# EAGLE design cdu (EAGLE 8.4.1)

## Sheet 1 of 9: USB
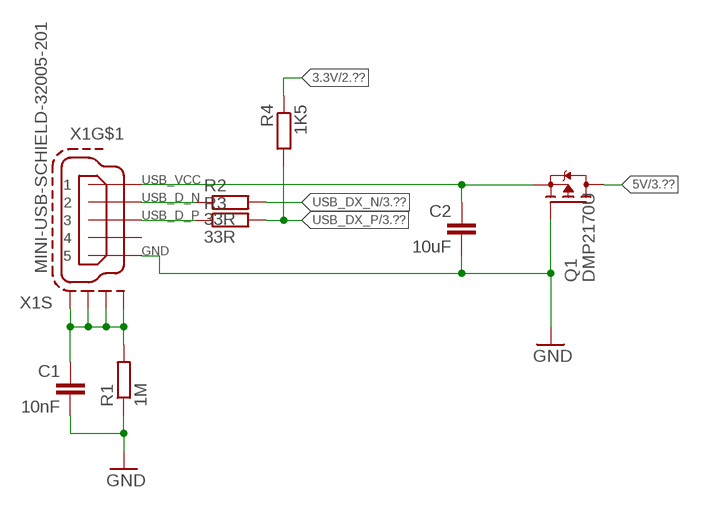
[diagram p0: schematic, sheet 1]

### Parts
C1  10nF  C-EUC0603  [C0603]
C2  10uF  C-EUC0805K  [C0805K]
Q1  DMP2170U  [SOT23]
R1  1M  R-EU_R0603  [R0603]
R2  33R  R-EU_R0603  [R0603]
R3  33R  R-EU_R0603  [R0603]
R4  1K5  R-EU_R0603  [R0603]
X1  MINI-USB-SCHIELD-32005-201  [32005-201]

### Nets
3.3V [Power]: R4.1 ; also sheet 2,3,4,6,8,9
5V [Power]: Q1.3(D) ; also sheet 3,5,6,9
GND [Power]: C1.2 C2.2 Q1.1(G) R1.1 X1.5 ; also sheet 2,3,4,5,6,7,9
N$60: C1.1 R1.2 X1.M1(S:S1) X1.M2(S:S2) X1.M3(S:S3) X1.M4(S:S4)
USB_D_N: R2.1 X1.2
USB_D_P: R3.1 X1.3
USB_DX_N: R2.2 ; also sheet 3
USB_DX_P: R3.2 R4.2 ; also sheet 3
USB_VCC: C2.1 Q1.2(S) X1.1
Unconnected: X1.4

## Sheet 2 of 9: CPLD LCMXO1200C-3TN144I breakout
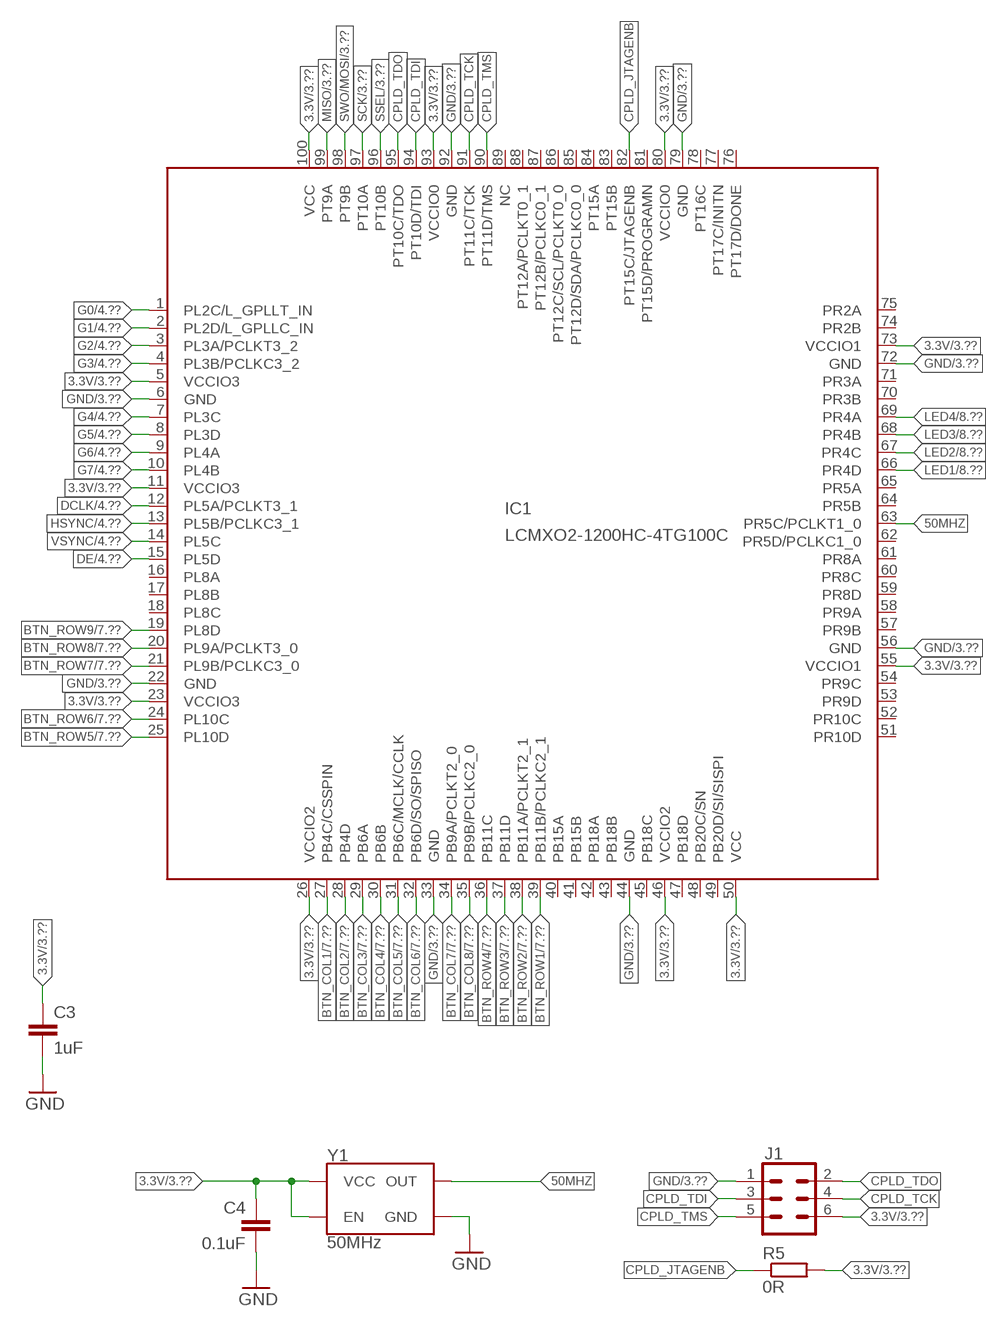
[diagram p1: schematic, sheet 2]

### Parts
C3  1uF  C-EUC0603  [C0603]
C4  0.1uF  C-EUC0603  [C0603]
IC1  LCMXO2-1200HC-4TG100C  [TQFP100]
J1  CONN_03X2FEMALE_SMD  [2X3_SMD]
R5  0R  R-EU_R0603  [R0603]
Y1  50MHz  LFSPXO019987  [CFPS-73]

### Nets
3.3V [Power]: C3.1 C4.1 IC1.5(VCCIO3) IC1.11(VCCIO3) IC1.23(VCCIO3) IC1.26(VCCIO2) IC1.46(VCCIO2) IC1.50(VCC) IC1.55(VCCIO1) IC1.73(VCCIO1) IC1.80(VCCIO0) IC1.93(VCCIO0) IC1.100(VCC) J1.6 R5.2 Y1.1(EN) Y1.4(VCC) ; also sheet 1,3,4,6,8,9
50MHZ: IC1.63(PR5C/PCLKT1_0) Y1.3(OUT)
BTN_COL1: IC1.27(PB4C/CSSPIN) ; also sheet 7
BTN_COL2: IC1.28(PB4D) ; also sheet 7
BTN_COL3: IC1.29(PB6A) ; also sheet 7
BTN_COL4: IC1.30(PB6B) ; also sheet 7
BTN_COL5: IC1.31(PB6C/MCLK/CCLK) ; also sheet 7
BTN_COL6: IC1.32(PB6D/SO/SPISO) ; also sheet 7
BTN_COL7: IC1.34(PB9A/PCLKT2_0) ; also sheet 7
BTN_COL8: IC1.35(PB9B/PCLKC2_0) ; also sheet 7
BTN_ROW1: IC1.39(PB11B/PCLKC2_1) ; also sheet 7
BTN_ROW2: IC1.38(PB11A/PCLKT2_1) ; also sheet 7
BTN_ROW3: IC1.37(PB11D) ; also sheet 7
BTN_ROW4: IC1.36(PB11C) ; also sheet 7
BTN_ROW5: IC1.25(PL10D) ; also sheet 7
BTN_ROW6: IC1.24(PL10C) ; also sheet 7
BTN_ROW7: IC1.21(PL9B/PCLKC3_0) ; also sheet 7
BTN_ROW8: IC1.20(PL9A/PCLKT3_0) ; also sheet 7
BTN_ROW9: IC1.19(PL8D) ; also sheet 7
CPLD_JTAGENB: IC1.82(PT15C/JTAGENB) R5.1
CPLD_TCK: IC1.91(PT11C/TCK) J1.4
CPLD_TDI: IC1.94(PT10D/TDI) J1.3
CPLD_TDO: IC1.95(PT10C/TDO) J1.2
CPLD_TMS: IC1.90(PT11D/TMS) J1.5
DCLK: IC1.12(PL5A/PCLKT3_1) ; also sheet 4
DE: IC1.15(PL5D) ; also sheet 4
G0: IC1.1(PL2C/L_GPLLT_IN) ; also sheet 4
G1: IC1.2(PL2D/L_GPLLC_IN) ; also sheet 4
G2: IC1.3(PL3A/PCLKT3_2) ; also sheet 4
G3: IC1.4(PL3B/PCLKC3_2) ; also sheet 4
G4: IC1.7(PL3C) ; also sheet 4
G5: IC1.8(PL3D) ; also sheet 4
G6: IC1.9(PL4A) ; also sheet 4
G7: IC1.10(PL4B) ; also sheet 4
GND [Power]: C3.2 C4.2 IC1.6(GND) IC1.22(GND) IC1.33(GND) IC1.44(GND) IC1.56(GND) IC1.72(GND) IC1.79(GND) IC1.92(GND) J1.1 Y1.2(GND) ; also sheet 1,3,4,5,6,7,9
HSYNC: IC1.13(PL5B/PCLKC3_1) ; also sheet 4
LED1: IC1.66(PR4D) ; also sheet 8
LED2: IC1.67(PR4C) ; also sheet 8
LED3: IC1.68(PR4B) ; also sheet 8
LED4: IC1.69(PR4A) ; also sheet 8
MISO: IC1.99(PT9A) ; also sheet 3
SCK: IC1.97(PT10A) ; also sheet 3
SSEL: IC1.96(PT10B) ; also sheet 3
SWO/MOSI: IC1.98(PT9B) ; also sheet 3
VSYNC: IC1.14(PL5C) ; also sheet 4
Unconnected: IC1.16(PL8A) IC1.17(PL8B) IC1.18(PL8C) IC1.40(PB15A) IC1.41(PB15B) IC1.42(PB18A) IC1.43(PB18B) IC1.45(PB18C) IC1.47(PB18D) IC1.48(PB20C/SN) IC1.49(PB20D/SI/SISPI) IC1.51(PR10D) IC1.52(PR10C) IC1.53(PR9D) IC1.54(PR9C) IC1.57(PR9B) IC1.58(PR9A) IC1.59(PR8D) IC1.60(PR8C) IC1.61(PR8A) IC1.62(PR5D/PCLKC1_0) IC1.64(PR5B) IC1.65(PR5A) IC1.70(PR3B) IC1.71(PR3A) IC1.74(PR2B) IC1.75(PR2A) IC1.76(PT17D/DONE) IC1.77(PT17C/INITN) IC1.78(PT16C) IC1.81(PT15D/PROGRAMN) IC1.83(PT15B) IC1.84(PT15A) IC1.85(PT12D/SDA/PCLKC0_0) IC1.86(PT12C/SCL/PCLKT0_0) IC1.87(PT12B/PCLKC0_1) IC1.88(PT12A/PCLKT0_1) IC1.89(NC)

## Sheet 3 of 9: MCU LPC1313 of 72MHz
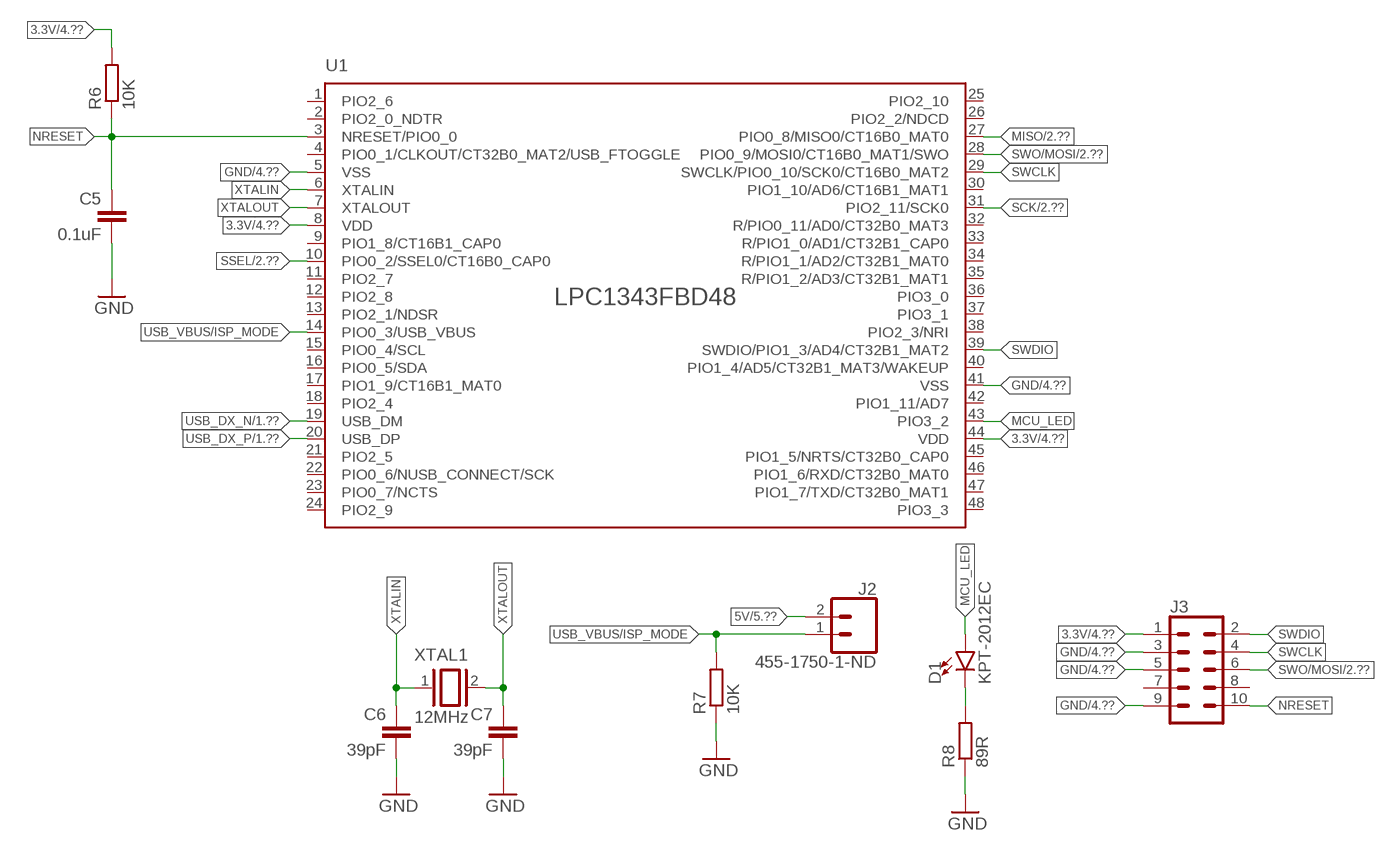
[diagram p2: schematic, sheet 3]

### Parts
C5  0.1uF  C-EUC0603  [C0603]
C6  39pF  C-EUC0603  [C0603]
C7  39pF  C-EUC0603  [C0603]
D1  KPT-2012EC  [KPT-2012EC]
J2  455-1750-1-ND  CONN_02SMD  [1X02_SMD]
J3  CONN_05X2SMD_12.7  [2X5_SMD_1.27MM]
R6  10K  R-EU_R0603  [R0603]
R7  10K  R-EU_R0603  [R0603]
R8  89R  R-EU_R0603  [R0603]
U1  LPC1343FBD48  [LQFP-48]
XTAL1  12MHz  CRYSTAL  [CAA-12.000-18-3050-X]

### Nets
3.3V [Power]: J3.1 R6.2 U1.8(VDD) U1.44(VDD) ; also sheet 1,2,4,6,8,9
5V [Power]: J2.2 ; also sheet 1,5,6,9
GND [Power]: C5.2 C6.2 C7.2 J3.3 J3.5 J3.9 R7.1 R8.1 U1.5(VSS) U1.41(VSS) ; also sheet 1,2,4,5,6,7,9
MCU_LED: D1.A U1.43(PIO3_2)
MISO: U1.27(PIO0_8/MISO0/CT16B0_MAT0) ; also sheet 2
N$6: D1.C R8.2
NRESET: C5.1 J3.10 R6.1 U1.3(NRESET/PIO0_0)
SCK: U1.31(PIO2_11/SCK0) ; also sheet 2
SSEL: U1.10(PIO0_2/SSEL0/CT16B0_CAP0) ; also sheet 2
SWCLK: J3.4 U1.29(SWCLK/PIO0_10/SCK0/CT16B0_MAT2)
SWDIO: J3.2 U1.39(SWDIO/PIO1_3/AD4/CT32B1_MAT2)
SWO/MOSI: J3.6 U1.28(PIO0_9/MOSI0/CT16B0_MAT1/SWO) ; also sheet 2
USB_DX_N: U1.19(USB_DM) ; also sheet 1
USB_DX_P: U1.20(USB_DP) ; also sheet 1
USB_VBUS/ISP_MODE: J2.1 R7.2 U1.14(PIO0_3/USB_VBUS)
XTALIN: C6.1 U1.6(XTALIN) XTAL1.1
XTALOUT: C7.1 U1.7(XTALOUT) XTAL1.2
Unconnected: J3.7 J3.8 U1.1(PIO2_6) U1.2(PIO2_0_NDTR) U1.4(PIO0_1/CLKOUT/CT32B0_MAT2/USB_FTOGGLE) U1.9(PIO1_8/CT16B1_CAP0) U1.11(PIO2_7) U1.12(PIO2_8) U1.13(PIO2_1/NDSR) U1.15(PIO0_4/SCL) U1.16(PIO0_5/SDA) U1.17(PIO1_9/CT16B1_MAT0) U1.18(PIO2_4) U1.21(PIO2_5) U1.22(PIO0_6/NUSB_CONNECT/SCK) U1.23(PIO0_7/NCTS) U1.24(PIO2_9) U1.25(PIO2_10) U1.26(PIO2_2/NDCD) U1.30(PIO1_10/AD6/CT16B1_MAT1) U1.32(R/PIO0_11/AD0/CT32B0_MAT3) U1.33(R/PIO1_0/AD1/CT32B1_CAP0) U1.34(R/PIO1_1/AD2/CT32B1_MAT0) U1.35(R/PIO1_2/AD3/CT32B1_MAT1) U1.36(PIO3_0) U1.37(PIO3_1) U1.38(PIO2_3/NRI) U1.40(PIO1_4/AD5/CT32B1_MAT3/WAKEUP) U1.42(PIO1_11/AD7) U1.45(PIO1_5/NRTS/CT32B0_CAP0) U1.46(PIO1_6/RXD/CT32B0_MAT0) U1.47(PIO1_7/TXD/CT32B0_MAT1) U1.48(PIO3_3)

## Sheet 4 of 9
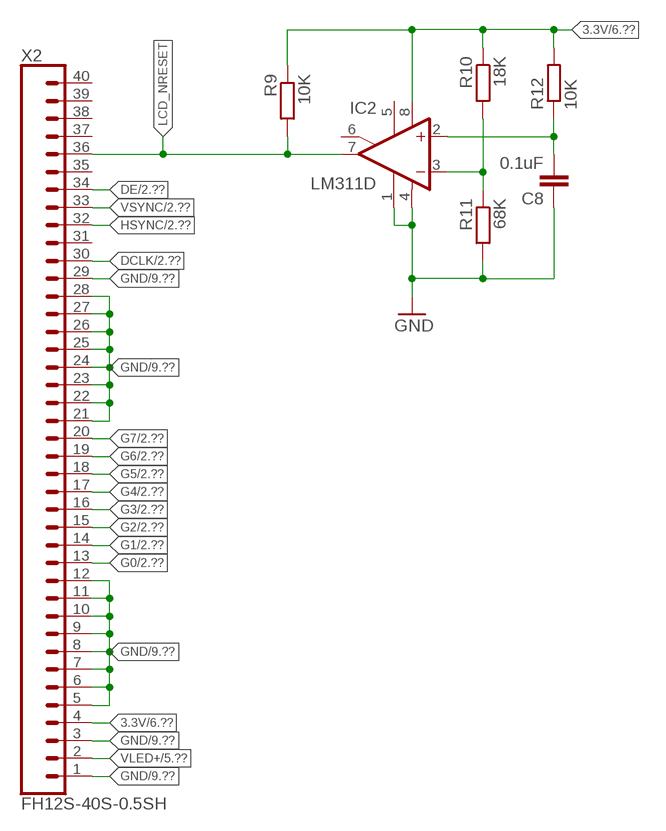
[diagram p3: schematic, sheet 4]

### Parts
C8  0.1uF  C-EUC0603  [C0603]
IC2  LM311D  [SO08]
R9  10K  R-EU_R0603  [R0603]
R10  18K  R-EU_R0603  [R0603]
R11  68K  R-EU_R0603  [R0603]
R12  10K  R-EU_R0603  [R0603]
X2  FH12S-40S-0.5SH  [FH12S-40S-0.5SH]

### Nets
3.3V [Power]: IC2.8(V+) R9.1 R10.1 R12.2 X2.4 ; also sheet 1,2,3,6,8,9
DCLK: X2.30 ; also sheet 2
DE: X2.34 ; also sheet 2
G0: X2.13 ; also sheet 2
G1: X2.14 ; also sheet 2
G2: X2.15 ; also sheet 2
G3: X2.16 ; also sheet 2
G4: X2.17 ; also sheet 2
G5: X2.18 ; also sheet 2
G6: X2.19 ; also sheet 2
G7: X2.20 ; also sheet 2
GND [Power]: C8.1 IC2.1(GND) IC2.4(V-) R11.2 X2.1 X2.3 X2.5 X2.6 X2.7 X2.8 X2.9 X2.10 X2.11 X2.12 X2.21 X2.22 X2.23 X2.24 X2.25 X2.26 X2.27 X2.28 X2.29 ; also sheet 1,2,3,5,6,7,9
HSYNC: X2.32 ; also sheet 2
LCD_NRESET: IC2.7(OUT) R9.2 X2.36
N$4: C8.2 IC2.2(+IN) R12.1
N$8: IC2.3(-IN) R10.2 R11.1
VLED+: X2.2 ; also sheet 5,9
VSYNC: X2.33 ; also sheet 2
Unconnected: IC2.5(ON) IC2.6(ON/STR) X2.31 X2.35 X2.37 X2.38 X2.39 X2.40

## Sheet 5 of 9: VLED SUPPLY 20V VLED power supply. The supply is rated for 30mA current.
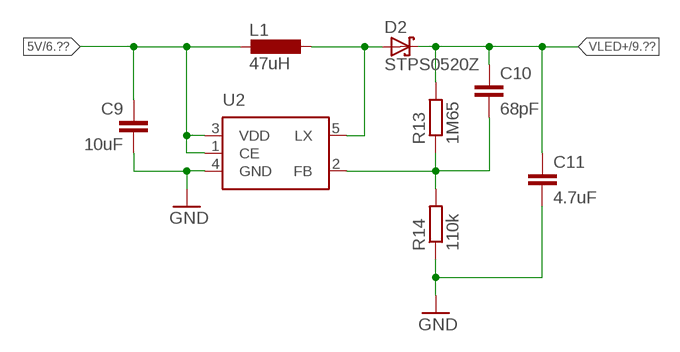
[diagram p4: schematic, sheet 5]

### Parts
C9  10uF  C-EUC0805K  [C0805K]
C10  68pF  C-EUC0603  [C0603]
C11  4.7uF  C-EUC0603  [C0603]
D2  STPS0520Z  [SOD123]
L1  47uH  TYS4018470M-10  [TYS4018470M-10]
R13  1M65  R-EU_R0603  [R0603]
R14  110k  R-EU_R0603  [R0603]
U2  NCP1406  [TSOP-5]

### Nets
5V [Power]: C9.1 L1.2 U2.1(CE) U2.3(VDD) ; also sheet 1,3,6,9
GND [Power]: C9.2 C11.2 R14.1 U2.4(GND) ; also sheet 1,2,3,4,6,7,9
N$1: D2.A L1.1 U2.5(LX)
N$3: C10.2 R13.1 R14.2 U2.2(FB)
VLED+: C10.1 C11.1 D2.C R13.2 ; also sheet 4,9

## Sheet 6 of 9: VCC 3.3V Power supply VCC 3.3V Power supply rated for 300mA
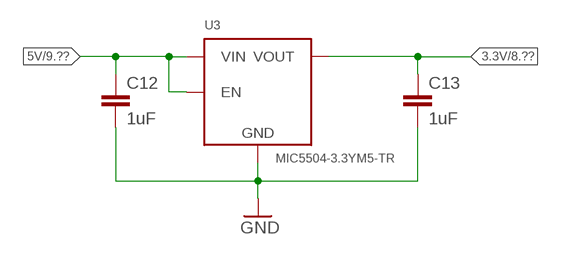
[diagram p5: schematic, sheet 6]

### Parts
C12  1uF  C-EUC0603  [C0603]
C13  1uF  C-EUC0603  [C0603]
U3  MIC5504-3.3YM5-TR  [SOT23-5]

### Nets
3.3V [Power]: C13.1 U3.5(VOUT) ; also sheet 1,2,3,4,8,9
5V [Power]: C12.1 U3.1(VIN) U3.3(EN) ; also sheet 1,3,5,9
GND [Power]: C12.2 C13.2 U3.2(GND) ; also sheet 1,2,3,4,5,7,9

## Sheet 7 of 9: Buttons Pull-Down tactile SMD buttons
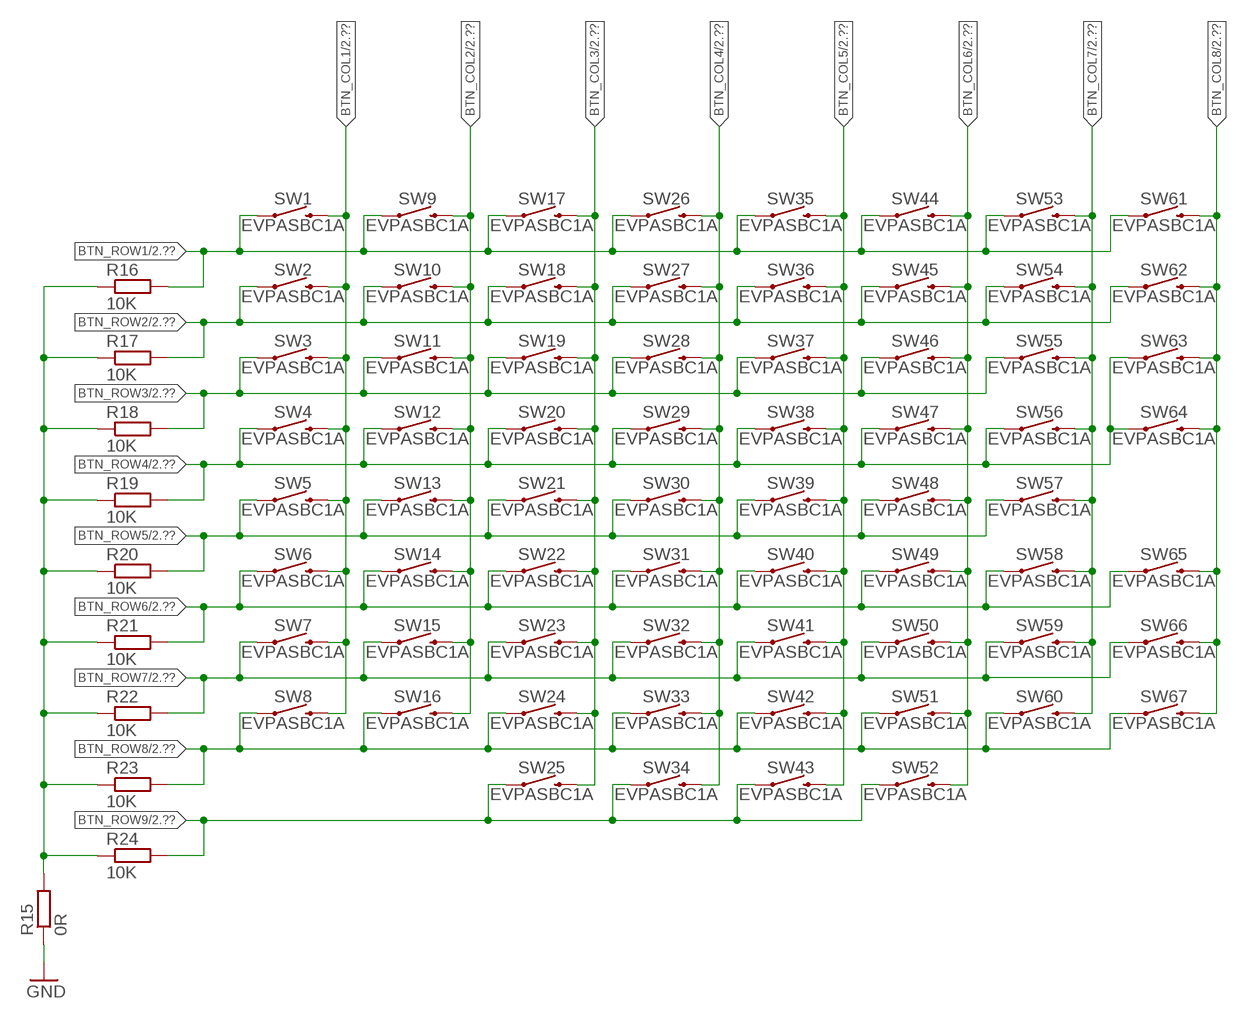
[diagram p6: schematic, sheet 7]

### Parts
R15  0R  R-EU_R0603  [R0603]
R16  10K  R-EU_R0603  [R0603]
R17  10K  R-EU_R0603  [R0603]
R18  10K  R-EU_R0603  [R0603]
R19  10K  R-EU_R0603  [R0603]
R20  10K  R-EU_R0603  [R0603]
R21  10K  R-EU_R0603  [R0603]
R22  10K  R-EU_R0603  [R0603]
R23  10K  R-EU_R0603  [R0603]
R24  10K  R-EU_R0603  [R0603]
SW1  EVPASBC1A  [EVPASBC1A]
SW2  EVPASBC1A  [EVPASBC1A]
SW3  EVPASBC1A  [EVPASBC1A]
SW4  EVPASBC1A  [EVPASBC1A]
SW5  EVPASBC1A  [EVPASBC1A]
SW6  EVPASBC1A  [EVPASBC1A]
SW7  EVPASBC1A  [EVPASBC1A]
SW8  EVPASBC1A  [EVPASBC1A]
SW9  EVPASBC1A  [EVPASBC1A]
SW10  EVPASBC1A  [EVPASBC1A]
SW11  EVPASBC1A  [EVPASBC1A]
SW12  EVPASBC1A  [EVPASBC1A]
SW13  EVPASBC1A  [EVPASBC1A]
SW14  EVPASBC1A  [EVPASBC1A]
SW15  EVPASBC1A  [EVPASBC1A]
SW16  EVPASBC1A  [EVPASBC1A]
SW17  EVPASBC1A  [EVPASBC1A]
SW18  EVPASBC1A  [EVPASBC1A]
SW19  EVPASBC1A  [EVPASBC1A]
SW20  EVPASBC1A  [EVPASBC1A]
SW21  EVPASBC1A  [EVPASBC1A]
SW22  EVPASBC1A  [EVPASBC1A]
SW23  EVPASBC1A  [EVPASBC1A]
SW24  EVPASBC1A  [EVPASBC1A]
SW25  EVPASBC1A  [EVPASBC1A]
SW26  EVPASBC1A  [EVPASBC1A]
SW27  EVPASBC1A  [EVPASBC1A]
SW28  EVPASBC1A  [EVPASBC1A]
SW29  EVPASBC1A  [EVPASBC1A]
SW30  EVPASBC1A  [EVPASBC1A]
SW31  EVPASBC1A  [EVPASBC1A]
SW32  EVPASBC1A  [EVPASBC1A]
SW33  EVPASBC1A  [EVPASBC1A]
SW34  EVPASBC1A  [EVPASBC1A]
SW35  EVPASBC1A  [EVPASBC1A]
SW36  EVPASBC1A  [EVPASBC1A]
SW37  EVPASBC1A  [EVPASBC1A]
SW38  EVPASBC1A  [EVPASBC1A]
SW39  EVPASBC1A  [EVPASBC1A]
SW40  EVPASBC1A  [EVPASBC1A]
SW41  EVPASBC1A  [EVPASBC1A]
SW42  EVPASBC1A  [EVPASBC1A]
SW43  EVPASBC1A  [EVPASBC1A]
SW44  EVPASBC1A  [EVPASBC1A]
SW45  EVPASBC1A  [EVPASBC1A]
SW46  EVPASBC1A  [EVPASBC1A]
SW47  EVPASBC1A  [EVPASBC1A]
SW48  EVPASBC1A  [EVPASBC1A]
SW49  EVPASBC1A  [EVPASBC1A]
SW50  EVPASBC1A  [EVPASBC1A]
SW51  EVPASBC1A  [EVPASBC1A]
SW52  EVPASBC1A  [EVPASBC1A]
SW53  EVPASBC1A  [EVPASBC1A]
SW54  EVPASBC1A  [EVPASBC1A]
SW55  EVPASBC1A  [EVPASBC1A]
SW56  EVPASBC1A  [EVPASBC1A]
SW57  EVPASBC1A  [EVPASBC1A]
SW58  EVPASBC1A  [EVPASBC1A]
SW59  EVPASBC1A  [EVPASBC1A]
SW60  EVPASBC1A  [EVPASBC1A]
SW61  EVPASBC1A  [EVPASBC1A]
SW62  EVPASBC1A  [EVPASBC1A]
SW63  EVPASBC1A  [EVPASBC1A]
SW64  EVPASBC1A  [EVPASBC1A]
SW65  EVPASBC1A  [EVPASBC1A]
SW66  EVPASBC1A  [EVPASBC1A]
SW67  EVPASBC1A  [EVPASBC1A]

### Nets
BTN_COL1: SW1.P$2 SW2.P$2 SW3.P$2 SW4.P$2 SW5.P$2 SW6.P$2 SW7.P$2 SW8.P$2 ; also sheet 2
BTN_COL2: SW9.P$2 SW10.P$2 SW11.P$2 SW12.P$2 SW13.P$2 SW14.P$2 SW15.P$2 SW16.P$2 ; also sheet 2
BTN_COL3: SW17.P$2 SW18.P$2 SW19.P$2 SW20.P$2 SW21.P$2 SW22.P$2 SW23.P$2 SW24.P$2 SW25.P$2 ; also sheet 2
BTN_COL4: SW26.P$2 SW27.P$2 SW28.P$2 SW29.P$2 SW30.P$2 SW31.P$2 SW32.P$2 SW33.P$2 SW34.P$2 ; also sheet 2
BTN_COL5: SW35.P$2 SW36.P$2 SW37.P$2 SW38.P$2 SW39.P$2 SW40.P$2 SW41.P$2 SW42.P$2 SW43.P$2 ; also sheet 2
BTN_COL6: SW44.P$2 SW45.P$2 SW46.P$2 SW47.P$2 SW48.P$2 SW49.P$2 SW50.P$2 SW51.P$2 SW52.P$2 ; also sheet 2
BTN_COL7: SW53.P$2 SW54.P$2 SW55.P$2 SW56.P$2 SW57.P$2 SW58.P$2 SW59.P$2 SW60.P$2 ; also sheet 2
BTN_COL8: SW61.P$2 SW62.P$2 SW63.P$2 SW64.P$2 SW65.P$2 SW66.P$2 SW67.P$2 ; also sheet 2
BTN_ROW1: R16.2 SW1.P$1 SW9.P$1 SW17.P$1 SW26.P$1 SW35.P$1 SW44.P$1 SW53.P$1 SW61.P$1 ; also sheet 2
BTN_ROW2: R17.2 SW2.P$1 SW10.P$1 SW18.P$1 SW27.P$1 SW36.P$1 SW45.P$1 SW54.P$1 SW62.P$1 ; also sheet 2
BTN_ROW3: R18.2 SW3.P$1 SW11.P$1 SW19.P$1 SW28.P$1 SW37.P$1 SW46.P$1 SW55.P$1 ; also sheet 2
BTN_ROW4: R19.2 SW4.P$1 SW12.P$1 SW20.P$1 SW29.P$1 SW38.P$1 SW47.P$1 SW56.P$1 SW63.P$1 SW64.P$1 ; also sheet 2
BTN_ROW5: R20.2 SW5.P$1 SW13.P$1 SW21.P$1 SW30.P$1 SW39.P$1 SW48.P$1 SW57.P$1 ; also sheet 2
BTN_ROW6: R21.2 SW6.P$1 SW14.P$1 SW22.P$1 SW31.P$1 SW40.P$1 SW49.P$1 SW58.P$1 SW65.P$1 ; also sheet 2
BTN_ROW7: R22.2 SW7.P$1 SW15.P$1 SW23.P$1 SW32.P$1 SW41.P$1 SW50.P$1 SW59.P$1 SW66.P$1 ; also sheet 2
BTN_ROW8: R23.2 SW8.P$1 SW16.P$1 SW24.P$1 SW33.P$1 SW42.P$1 SW51.P$1 SW60.P$1 SW67.P$1 ; also sheet 2
BTN_ROW9: R24.2 SW25.P$1 SW34.P$1 SW43.P$1 SW52.P$1 ; also sheet 2
GND [Power]: R15.1 ; also sheet 1,2,3,4,5,6,9
N$10: R15.2 R16.1 R17.1 R18.1 R19.1 R20.1 R21.1 R22.1 R23.1 R24.1

## Sheet 8 of 9: LED's
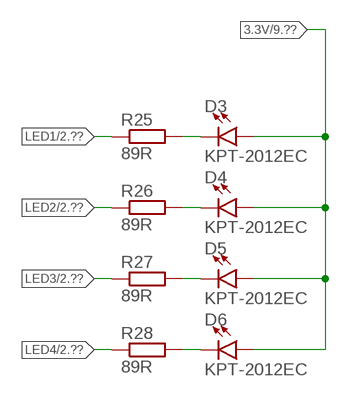
[diagram p7: schematic, sheet 8]

### Parts
D3  KPT-2012EC  [KPT-2012EC]
D4  KPT-2012EC  [KPT-2012EC]
D5  KPT-2012EC  [KPT-2012EC]
D6  KPT-2012EC  [KPT-2012EC]
R25  89R  R-EU_R0603  [R0603]
R26  89R  R-EU_R0603  [R0603]
R27  89R  R-EU_R0603  [R0603]
R28  89R  R-EU_R0603  [R0603]

### Nets
3.3V [Power]: D3.A D4.A D5.A D6.A ; also sheet 1,2,3,4,6,9
LED1: R25.1 ; also sheet 2
LED2: R26.1 ; also sheet 2
LED3: R27.1 ; also sheet 2
LED4: R28.1 ; also sheet 2
N$5: D4.C R26.2
N$7: D5.C R27.2
N$9: D6.C R28.2
N$17: D3.C R25.2

## Sheet 9 of 9: Test points
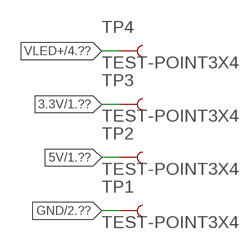
[diagram p8: schematic, sheet 9]

### Parts
TP1  TEST-POINT3X4  [PAD.03X.04]
TP2  TEST-POINT3X4  [PAD.03X.04]
TP3  TEST-POINT3X4  [PAD.03X.04]
TP4  TEST-POINT3X4  [PAD.03X.04]

### Nets
3.3V [Power]: TP3.P$1 ; also sheet 1,2,3,4,6,8
5V [Power]: TP2.P$1 ; also sheet 1,3,5,6
GND [Power]: TP1.P$1 ; also sheet 1,2,3,4,5,6,7
VLED+: TP4.P$1 ; also sheet 4,5

## Library data of the parts
C1-C13 = resistor:C-EU: CAPACITOR, European symbol
D1 D3-D6 = mylib:KPT-2012EC
D2 = mylib:STPS0520Z
IC1 = mylib:LCMXO2-1200HC-4TG100C: edit this description Auto generated by make-symbol-device-package-bsdl.ulp Rev. 44 Source:
IC2 = linear:LM311: COMPARATOR
J1 = SparkFun-Connectors:CONN_03X2: Multi connection point. Often used as Generic Header-pin footprint for 0.1 inch spaced/style header connections You can populate with any combo of single row headers, but if you'd like an exact match, check these: Header - 2x3 (Male, 0.1") <https://www.sparkfun.com/products/12807> (PRT-12807) Header - 2x3 (Female, 0.1") <https://www.sparkfun.com/products/13010> (PRT-13010) 2x3 Pin Shrouded Header <https://www.sparkfun.com/products/10877> (PRT-10877) On any of the 0.1 inch spaced packages, you can populate with these: Break Away Headers - Straight <https://www.sparkfun.com/products/116> (PRT-00116) Break Away Male Headers - Right Angle <https://www.sparkfun.com/products/553> (PRT-00553) Female Headers <https://www.sparkfun.com/products/115> (PRT-00115) Break Away Headers - Machine Pin <https://www.sparkfun.com/products/117> (PRT-00117) Break Away Female Headers - Swiss Machine Pin <https://www.sparkfun.com/products/743> (PRT-00743) Special note: the shrouded connector mates well with our 3x2 ribbon cables: Ribbon Crimp Connector - 6-pin (2x3, Female) <https://www.sparkfun.com/products/10651> (PRT-10651) Ribbon Cable - 6 wire (15ft) <https://www.sparkfun.com/products/10646> (PRT-10646); PROD_ID: CONN-11290
J2 = SparkFun-Connectors:CONN_02: Multi connection point. Often used as Generic Header-pin footprint for 0.1 inch spaced/style header connections On any of the 0.1 inch spaced packages, you can populate with these: Break Away Headers - Straight <https://www.sparkfun.com/products/116> (PRT-00116) Break Away Male Headers - Right Angle <https://www.sparkfun.com/products/553> (PRT-00553) Female Headers <https://www.sparkfun.com/products/115> (PRT-00115) Break Away Headers - Machine Pin <https://www.sparkfun.com/products/117> (PRT-00117) Break Away Female Headers - Swiss Machine Pin <https://www.sparkfun.com/products/743> (PRT-00743) For SCREWTERMINALS and SPRING TERMINALS visit here: Screw Terimnals on SparkFun.com <https://www.sparkfun.com/search/results?term=Screw+Terminals> (5mm/3.5mm/2.54mm spacing) This device is also useful as a general connection point to wire up your design to another part of your project. Our various solder wires solder well into these plated through hole pads. Hook-Up Wire - Assortment (Stranded, 22 AWG) <https://www.sparkfun.com/products/11375> (PRT-11375) Hook-Up Wire - Assortment (Solid Core, 22 AWG) <https://www.sparkfun.com/products/11367> (PRT-11367) View the entire wire category on our website here <https://www.sparkfun.com/categories/141> Special notes: Molex polarized connector foot print use with: PRT-08233 with associated crimp pins and housings. 2.54_SCREWTERM for use with PRT-10571. 3.5mm Screw Terminal footprints for PRT-08084 5mm Screw Terminal footprints for use with PRT-08432
J3 = SparkFun-Connectors:CONN_05X2: Multi connection point. Often used as Generic Header-pin footprint for 0.1 inch spaced/style header connections For AVR SPI programming port, see special device with nice symbol: "AVR_SPI_PROG_5x2.dev" You can populate with any combo of single row headers, but if you'd like an exact match, check these: 2x5 AVR ICSP Male Header <https://www.sparkfun.com/products/778> (PRT-00778) 2x5 Pin Shrouded Header <https://www.sparkfun.com/products/8506> (PRT-08506) On any of the 0.1 inch spaced packages, you can populate with these: Break Away Headers - Straight <https://www.sparkfun.com/products/116> (PRT-00116) Break Away Male Headers - Right Angle <https://www.sparkfun.com/products/553> (PRT-00553) Female Headers <https://www.sparkfun.com/products/115> (PRT-00115) Break Away Headers - Machine Pin <https://www.sparkfun.com/products/117> (PRT-00117) Break Away Female Headers - Swiss Machine Pin <https://www.sparkfun.com/products/743> (PRT-00743) Special note: the shrouded connector mates well with our 5x2 ribbon cables: 2x5 Pin IDC Ribbon Cable <https://www.sparkfun.com/products/8535> (PRT-08535)
L1 = mylib:TYS4018470M-10
Q1 = mylib:DMP2170U
R1-R28 = resistor:R-EU_: RESISTOR, European symbol
SW1-SW67 = mylib:EVPASBC1A
TP1-TP4 = SparkFun-Connectors:TEST-POINT: SparkFun Test Points Bare copper test points for troubleshooting or In-Circuit-Testing. These are used by our Production team for verifying production board runs using pogo-pins on test beds. SparkFun Products: SparkFun LSM9DS1 Breakout <https://www.sparkfun.com/products/13284> SparkFun PSOC <https://www.sparkfun.com/products/13714> SparkFun Load Cell Amplifier <https://www.sparkfun.com/products/13879>
U1 = mylib:LPC1343
U2 = mylib:NCP1406
U3 = mylib:MIC5504; SPICEPREFIX: E
X1 = con-cypressindustries:MINI-USB-SCHIELD-: MINI USB-B Conector Source: www.cypressindustries.com; OC_FARNELL: unknown; OC_NEWARK: unknown
X2 = mylib:FH12S-40S-0.5SH
XTAL1 = mylib:CRYSTAL
Y1 = mylib:LFSPXO019987

## Net classes
1 Power: width 0.203 mm

## Board
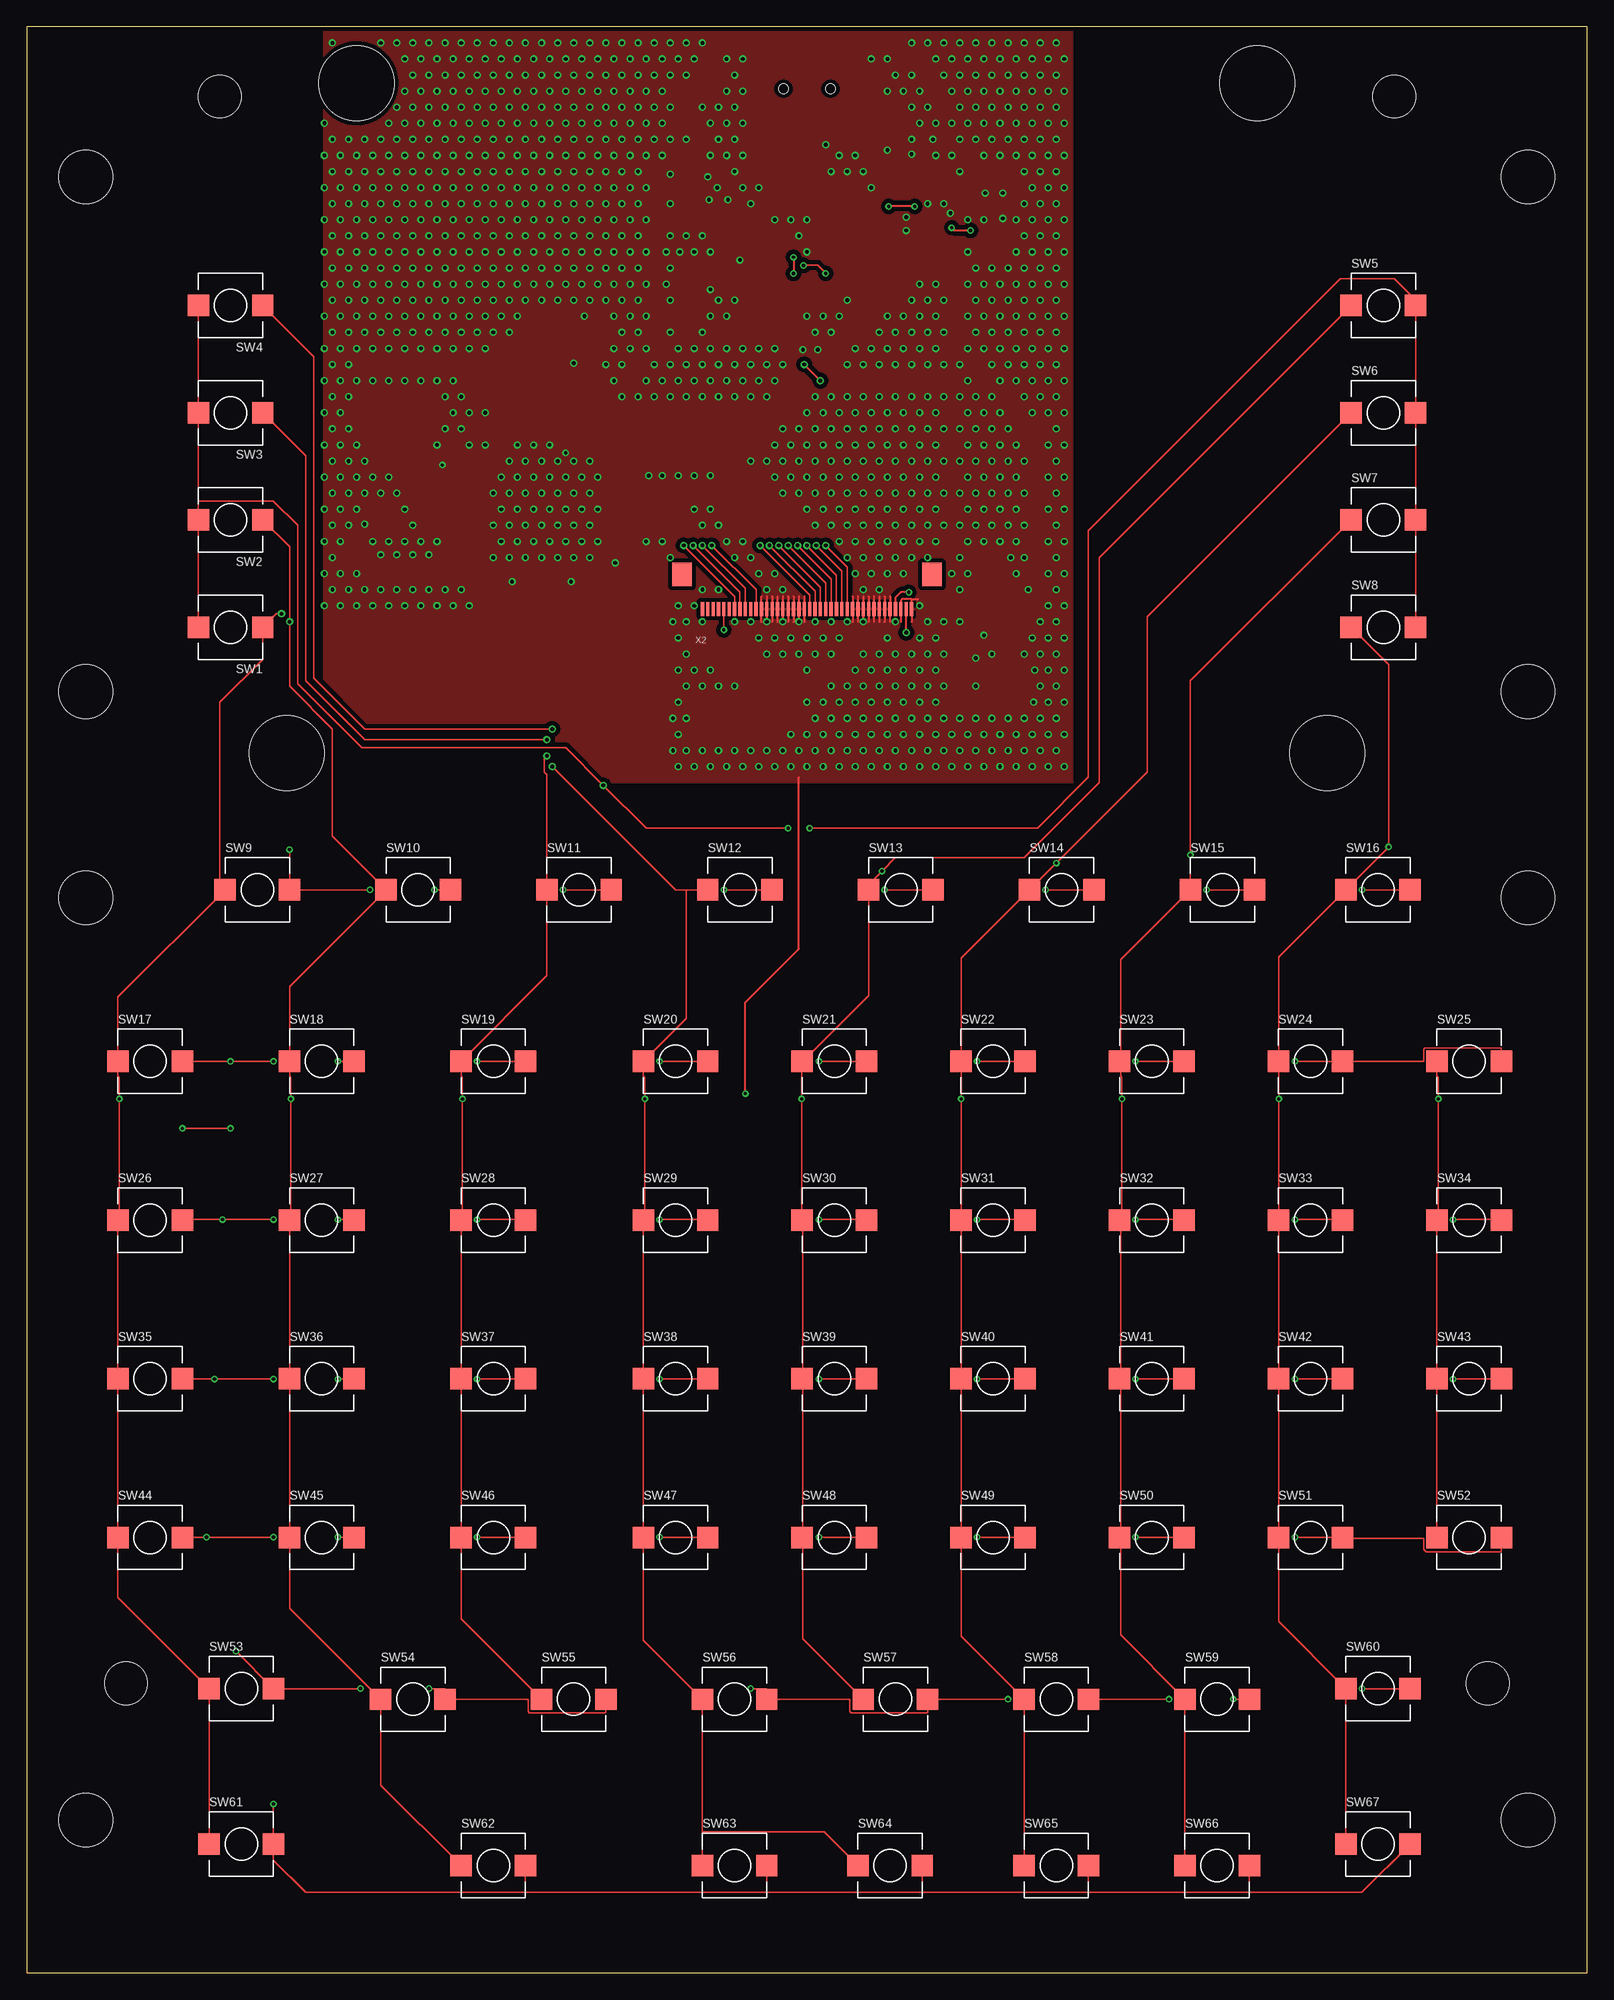
[diagram p9: board, top side]
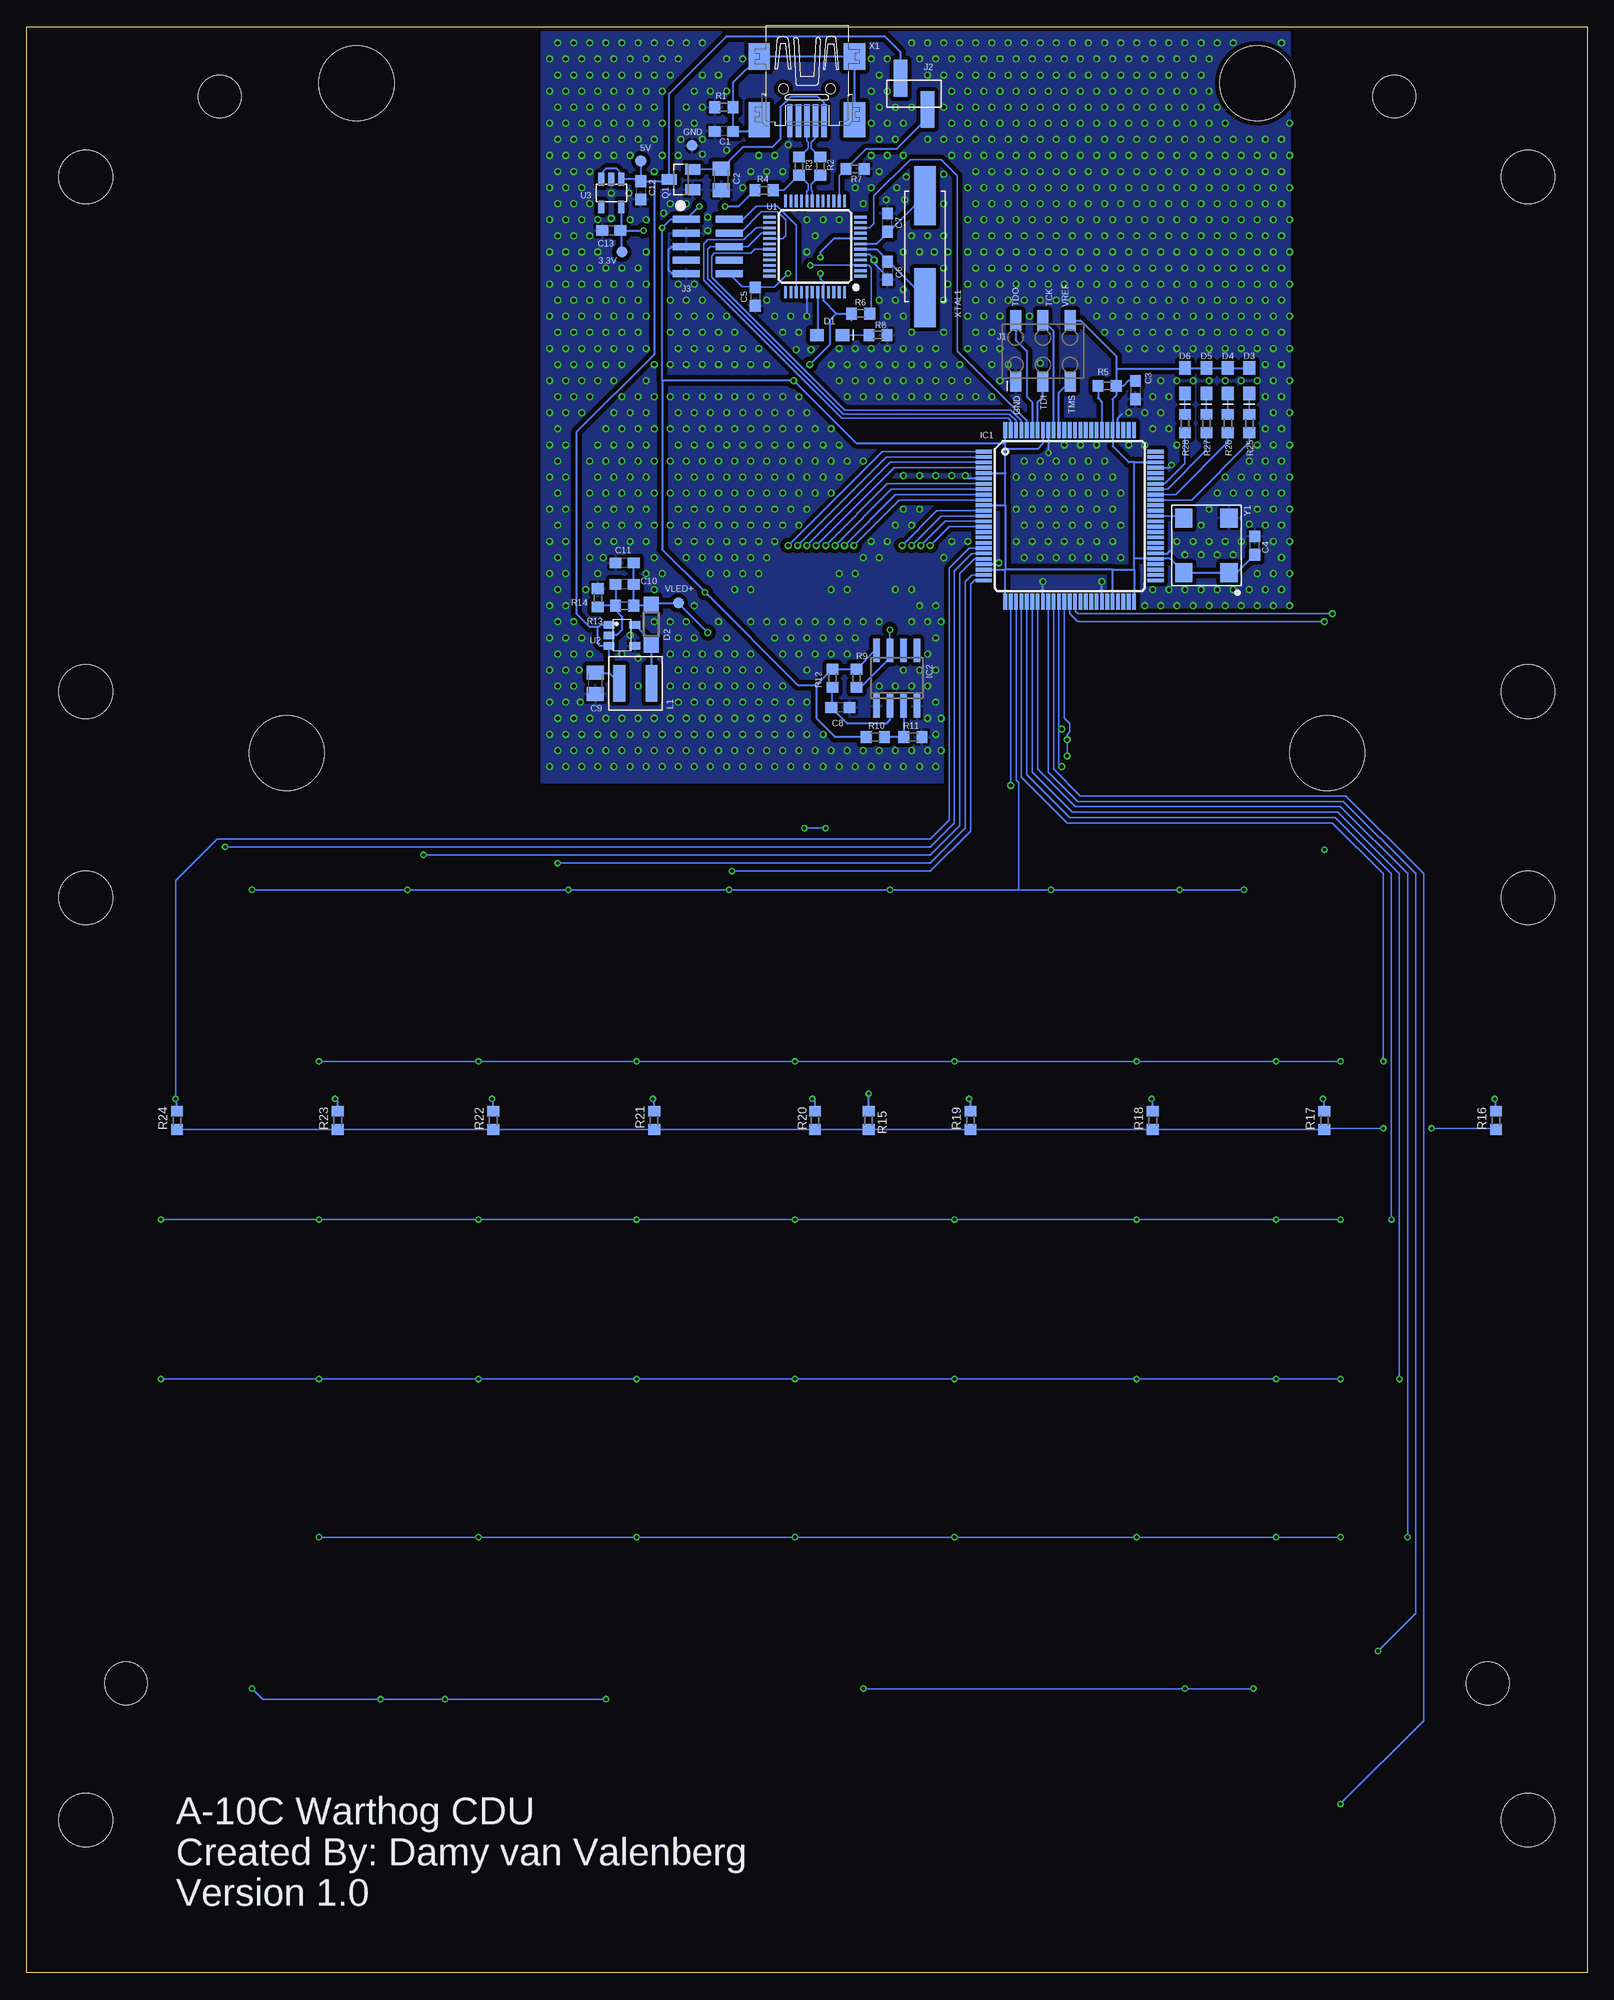
[diagram p10: board, bottom side, seen from below]

Size 145.5 x 181.5 mm. Coordinates in mm from the lower left corner, seen from the top.
Outline: 0,0 145.5,0 145.5,181.5 0,181.5 0,0
Copper layers (1*16): Top 0.035mm / dielectric 1.5mm / Bottom 0.035mm
Design rules "allpcb *": minimum track width 6mil, minimum drill 0.3mm, track to track 6mil, track to pad 6mil, pad to pad 5mil, via to via 6mil, smd to smd 6mil, copper to edge 0.3mm, drill to drill 6mil, minimum pad ring 6mil, minimum via ring 6mil, stop-mask expansion 1mil, vias tented up to drill 25mil, thermal gap 10mil
Holes 4 mm at 18,175 127.5,175 136.25,27 9.25,27
Holes 7 mm at 30.75,176.25 114.75,176.25 24.25,113.75 121.25,113.75
Holes 5 mm at 5.5,167.5 140,100.25 140,14.25 140,167.5 140,119.5 5.5,100.25 5.5,14.25 5.5,119.5

### Footprints (pad centres in the part's own frame; a part is rotated, then mirrored left to right if it is on the bottom)
C0603 = smd 1.1 x 1: 1 -0.85,0; 2 0.85,0
C0805K = smd 1.3 x 1.6: 1 -1,0; 2 1,0
KPT-2012EC = smd 1.25 x 1.1: A -1.175,0; C 1.175,0
SOD123 = smd 1.4 x 1.4: A 1.9,0; C -1.9,0
TQFP100 = smd 1.5 x 0.35: 1 -8,6; 2 -8,5.5; 3 -8,5; 4 -8,4.5; 5 -8,4; 6 -8,3.5; 7 -8,3; 8 -8,2.5; 9 -8,2; 10 -8,1.5; 11 -8,1; 12 -8,0.5; 13 -8,0; 14 -8,-0.5; 15 -8,-1; 16 -8,-1.5; 17 -8,-2; 18 -8,-2.5; 19 -8,-3; 20 -8,-3.5; 21 -8,-4; 22 -8,-4.5; 23 -8,-5; 24 -8,-5.5; 25 -8,-6; 51 8,-6; 52 8,-5.5; 53 8,-5; 54 8,-4.5; 55 8,-4; 56 8,-3.5; 57 8,-3; 58 8,-2.5; 59 8,-2; 60 8,-1.5; 61 8,-1; 62 8,-0.5; 63 8,0; 64 8,0.5; 65 8,1; 66 8,1.5; 67 8,2; 68 8,2.5; 69 8,3; 70 8,3.5; 71 8,4; 72 8,4.5; 73 8,5; 74 8,5.5; 75 8,6 | smd 0.35 x 1.5: 26 -6,-8; 27 -5.5,-8; 28 -5,-8; 29 -4.5,-8; 30 -4,-8; 31 -3.5,-8; 32 -3,-8; 33 -2.5,-8; 34 -2,-8; 35 -1.5,-8; 36 -1,-8; 37 -0.5,-8; 38 0,-8; 39 0.5,-8; 40 1,-8; 41 1.5,-8; 42 2,-8; 43 2.5,-8; 44 3,-8; 45 3.5,-8; 46 4,-8; 47 4.5,-8; 48 5,-8; 49 5.5,-8; 50 6,-8; 76 6,8; 77 5.5,8; 78 5,8; 79 4.5,8; 80 4,8; 81 3.5,8; 82 3,8; 83 2.5,8; 84 2,8; 85 1.5,8; 86 1,8; 87 0.5,8; 88 0,8; 89 -0.5,8; 90 -1,8; 91 -1.5,8; 92 -2,8; 93 -2.5,8; 94 -3,8; 95 -3.5,8; 96 -4,8; 97 -4.5,8; 98 -5,8; 99 -5.5,8; 100 -6,8
SO08 = smd 0.6 x 2.2: 1 -1.905,-2.6; 2 -0.635,-2.6; 3 0.635,-2.6; 4 1.905,-2.6; 5 1.905,2.6; 6 0.635,2.6; 7 -0.635,2.6; 8 -1.905,2.6
2X3_SMD = smd 1.02 x 1.9: 1 -2.54,-2.85; 2 -2.54,2.85; 3 0,-2.85; 4 0,2.85; 5 2.54,-2.85; 6 2.54,2.85
1X02_SMD = smd 1.27 x 3.43: 1 -1.27,1.46; 2 1.27,-1.46
2X5_SMD_1.27MM = smd 0.65 x 2.5: 1 -2.54,-2; 2 -2.54,2; 3 -1.27,-2; 4 -1.27,2; 5 0,-2; 6 0,2; 7 1.27,-2; 8 1.27,2; 9 2.54,-2; 10 2.54,2
TYS4018470M-10 = smd 1.1 x 3.4: 1 -1.5,0; 2 1.5,0
SOT23 = smd 1 x 1.4: 1 -0.95,-1.1; 2 0.95,-1.1; 3 0,1.1
R0603 = smd 1 x 1.1: 1 -0.85,0; 2 0.85,0
EVPASBC1A = smd 2 x 2: P$1 -3,0; P$2 3,0
PAD.03X.04 = smd 1.016 x 1.016: P$1 0,0
LQFP-48 = smd 0.254 x 1.143: 1 -2.75,-4.25; 2 -2.25,-4.25; 3 -1.75,-4.25; 4 -1.25,-4.25; 5 -0.75,-4.25; 6 -0.25,-4.25; 7 0.25,-4.25; 8 0.75,-4.25; 9 1.25,-4.25; 10 1.75,-4.25; 11 2.25,-4.25; 12 2.75,-4.25; 25 2.75,4.25; 26 2.25,4.25; 27 1.75,4.25; 28 1.25,4.25; 29 0.75,4.25; 30 0.25,4.25; 31 -0.25,4.25; 32 -0.75,4.25; 33 -1.25,4.25; 34 -1.75,4.25; 35 -2.25,4.25; 36 -2.75,4.25 | smd 1.143 x 0.254: 13 4.25,-2.75; 14 4.25,-2.25; 15 4.25,-1.75; 16 4.25,-1.25; 17 4.25,-0.75; 18 4.25,-0.25; 19 4.25,0.25; 20 4.25,0.75; 21 4.25,1.25; 22 4.25,1.75; 23 4.25,2.25; 24 4.25,2.75; 37 -4.25,2.75; 38 -4.25,2.25; 39 -4.25,1.75; 40 -4.25,1.25; 41 -4.25,0.75; 42 -4.25,0.25; 43 -4.25,-0.25; 44 -4.25,-0.75; 45 -4.25,-1.25; 46 -4.25,-1.75; 47 -4.25,-2.25; 48 -4.25,-2.75
TSOP-5 = smd 0.7 x 1: 1 -0.99,-1.2; 2 0,-1.2; 3 0.99,-1.2; 4 0.99,1.2; 5 -0.99,1.2
SOT23-5 = smd 0.55 x 1.2: 1 -0.95,-1.3; 2 0,-1.3; 3 0.95,-1.3; 4 0.95,1.3; 5 -0.95,1.3
32005-201 = smd 3.1 x 0.5: 1 3,1.6; 2 3,0.8; 3 3,0; 4 3,-0.8; 5 3,-1.6 | smd 2.5 x 2: M1 -3,-4.45; M2 -3,4.45 | smd 3.3 x 2: M3 2.9,4.45; M4 2.9,-4.45 | hole 0.9: 0,2.2; 0,-2.2
FH12S-40S-0.5SH = smd 0.3 x 1.3: 1 9.75,0; 2 9.25,0; 3 8.75,0; 4 8.25,0; 5 7.75,0; 6 7.25,0; 7 6.75,0; 8 6.25,0; 9 5.75,0; 10 5.25,0; 11 4.75,0; 12 4.25,0; 13 3.75,0; 14 3.25,0; 15 2.75,0; 16 2.25,0; 17 1.75,0; 18 1.25,0; 19 0.75,0; 20 0.25,0; 21 -0.25,0; 22 -0.75,0; 23 -1.25,0; 24 -1.75,0; 25 -2.25,0; 26 -2.75,0; 27 -3.25,0; 28 -3.75,0; 29 -4.25,0; 30 -4.75,0; 31 -5.25,0; 32 -5.75,0; 33 -6.25,0; 34 -6.75,0; 35 -7.25,0; 36 -7.75,0; 37 -8.25,0; 38 -8.75,0; 39 -9.25,0; 40 -9.75,0 | smd 1.8 x 2.2: NC@0 -11.65,3.25; NC@1 11.65,3.25
CAA-12.000-18-3050-X = smd 5.5 x 2: 1 -4.75,0; 2 4.75,0
CFPS-73 = smd 1.8 x 1.6: 1 2.54,2.1; 2 -2.54,2.1; 3 -2.54,-2.1; 4 2.54,-2.1

### Placement (x,y rotation side)
C1  80.5,171.75 180 bottom
C2  80.75,167.25 270 bottom
C3  42.12,147.62 270 bottom
C4  31,133.12 90 bottom
C5  77.58,156.35 270 bottom
C6  65.25,158.75 270 bottom
C7  65.25,163.25 90 bottom
C8  69.62,118 180 bottom
C9  92.5,120.25 270 bottom
C10  89.75,129.5 180 bottom
C11  89.75,131.5 180 bottom
C12  88.25,166.25 270 bottom
C13  91,162.5 180 bottom
D1  70.62,152.75 0 bottom
D2  87.25,125.75 270 bottom
D3  31.5,148.5 270 bottom
D4  33.5,148.5 270 bottom
D5  35.5,148.5 270 bottom
D6  37.5,148.5 270 bottom
IC1  48.25,135.88 0 bottom
IC2  64.38,120.75 0 bottom
J1  50.75,151.25 0 bottom
J2  62.77,175.25 180 bottom
J3  82,161 270 bottom
L1  88.75,120.25 180 bottom
Q1  84.5,167.25 90 bottom
R1  80.5,174 0 bottom
R2  71.5,168.5 270 bottom
R3  73.5,168.5 270 bottom
R4  76.75,166.25 0 bottom
R5  44.75,148 0 bottom
R6  67.75,154.75 180 bottom
R7  68.25,168.25 180 bottom
R8  66.12,152.75 180 bottom
R9  68.12,120.75 270 bottom
R10  66.38,115.25 0 bottom
R11  62.88,115.25 0 bottom
R12  70.38,120.75 90 bottom
R13  89.75,127.5 0 bottom
R14  92.25,128.25 270 bottom
R15  67,79.5 270 bottom
R16  8.5,79.5 90 bottom
R17  24.5,79.5 90 bottom
R18  40.5,79.5 90 bottom
R19  57.5,79.5 90 bottom
R20  72,79.5 90 bottom
R21  87,79.5 90 bottom
R22  102,79.5 90 bottom
R23  116.5,79.5 90 bottom
R24  131.5,79.5 90 bottom
R25  31.5,144.5 90 bottom
R26  33.5,144.5 90 bottom
R27  35.5,144.5 90 bottom
R28  37.5,144.5 90 bottom
SW1  19,125.5 180 top
SW2  19,135.5 180 top
SW3  19,145.5 180 top
SW4  19,155.5 180 top
SW5  126.5,155.5 0 top
SW6  126.5,145.5 0 top
SW7  126.5,135.5 0 top
SW8  126.5,125.5 0 top
SW9  21.5,101 0 top
SW10  36.5,101 0 top
SW11  51.5,101 0 top
SW12  66.5,101 0 top
SW13  81.5,101 0 top
SW14  96.5,101 0 top
SW15  111.5,101 0 top
SW16  126,101 0 top
SW17  11.5,85 0 top
SW18  27.5,85 0 top
SW19  43.5,85 0 top
SW20  60.5,85 0 top
SW21  75.3,85 0 top
SW22  90.1,85 0 top
SW23  104.9,85 0 top
SW24  119.7,85 0 top
SW25  134.5,85 0 top
SW26  11.5,70.2 0 top
SW27  27.5,70.2 0 top
SW28  43.5,70.2 0 top
SW29  60.5,70.2 0 top
SW30  75.3,70.2 0 top
SW31  90.1,70.2 0 top
SW32  104.9,70.2 0 top
SW33  119.7,70.2 0 top
SW34  134.5,70.2 0 top
SW35  11.5,55.4 0 top
SW36  27.5,55.4 0 top
SW37  43.5,55.4 0 top
SW38  60.5,55.4 0 top
SW39  75.3,55.4 0 top
SW40  90.1,55.4 0 top
SW41  104.9,55.4 0 top
SW42  119.7,55.4 0 top
SW43  134.5,55.4 0 top
SW44  11.5,40.6 0 top
SW45  27.5,40.6 0 top
SW46  43.5,40.6 0 top
SW47  60.5,40.6 0 top
SW48  75.3,40.6 0 top
SW49  90.1,40.6 0 top
SW50  104.9,40.6 0 top
SW51  119.7,40.6 0 top
SW52  134.5,40.6 0 top
SW53  20,26.5 0 top
SW54  36,25.5 0 top
SW55  51,25.5 0 top
SW56  66,25.5 0 top
SW57  81,25.5 0 top
SW58  96,25.5 0 top
SW59  111,25.5 0 top
SW60  126,26.5 0 top
SW61  20,12 0 top
SW62  43.5,10 0 top
SW63  66,10 0 top
SW64  80.5,10 0 top
SW65  96,10 0 top
SW66  111,10 0 top
SW67  126,12 0 top
TP1  83.45,170.43 0 bottom
TP2  88.25,169 0 bottom
TP3  90,160.5 0 bottom
TP4  84.75,127.75 0 bottom
U1  72,161 90 bottom
U2  90,124.75 270 bottom
U3  91,166 180 bottom
X1  72.75,175.73 270 bottom
X2  72.75,127.17 0 top
XTAL1  61.75,161 90 bottom
Y1  35.5,133.12 270 bottom

### Tracks (layer width: path | path; a pad name or v marks a point on that pad's centre or on a via)
3.3V  (via drill 0.3, 0.35)
  Top 0.203: v71.5,160 v71.5,158.5 | v88,162.5 86.5,162.5 v86.25,162.75 | v82.25,128.75 81.5,128.75 81,128.25 X2.4 | v82.79,164.75 v80.38,164.75 | v72.5,150 v74,148.5
  Bottom 0.203: U3.5 90.05,162.6 | 90.05,162.6 C13.1 90,162.35 TP3.P$1 | v82.79,164.75 J3.1 85.46,163.54 v86.25,162.75 86.25,148.5 | U1.8 70.25,161.75 71.5,160.5 v71.5,160 | v71.5,158.5 71.5,158 71.25,157.75 U1.44 71.25,156 70,154.75 | R4.1 79.1,164.75 v80.38,164.75 | IC2.8 66.38,123.35 R9.1 R12.2 71.88,120.1 | R10.1 70.12,115.25 71.88,117 71.88,120.1 | 90.05,162.6 89.95,162.5 v88,162.5 | Y1.1 32.69,130.59 C4.1 30.9,132.38 | Y1.1 Y1.4 38.89,131.88 IC1.55 42.25,131.88 | IC1.26 54.25,130.88 | 54.25,136.88 54.25,139.88 | 54.25,136.88 54.25,130.88 | 54.25,139.88 54.25,142.12 | 54.25,142.12 54.25,142.62 | 54.25,142.62 IC1.100 | 42.25,130.88 42.25,131.88 | 42.25,130.88 IC1.50 | 42.25,131.88 42.25,140.88 | 42.25,140.88 IC1.73 | 42.25,140.88 42.75,140.88 44.25,142.38 IC1.80 44.25,146.75 43.9,147.1 R5.2 | IC1.93 50.75,142.62 51.25,142.12 54.25,142.12 | R5.2 43.9,148.1 | 70,154.75 R6.2 68.6,154.1 | 33.38,130.56 Y1.1 | 71.88,120.1 73.6,120.1 v82.25,128.75 86.25,132.75 86.25,148.5 | IC1.23 54.25,130.88 | 44.25,130.88 54.25,130.88 | 44.25,130.88 42.25,130.88 | IC1.46 44.25,130.88 | D3.A D4.A D5.A D6.A 37.55,149.62 43.9,149.62 | J1.6 47.23,154.1 43.9,150.78 43.9,149.62 | 43.9,149.62 R5.2 | IC1.5 54.25,139.88 | IC1.11 54.25,136.88 | 70,154.75 70.62,154.12 70.62,151.88 v72.5,150 | 86.25,148.5 v74,148.5 68.12,142.62 54.25,142.62 | C3.1 42.77,148.47 43.25,148 R5.2
5V
  Bottom 0.203: 91.2,121.2 L1.2 | 91.2,121.2 U2.3 92.01,123.76 92.25,124 92.25,125.5 | C9.1 92.45,121.2 91.2,121.2 | 92.25,125.5 92,125.75 U2.1 | 87,167.1 C12.1 88.33,167.18 | 87,167.1 85.75,167.1 Q1.3 85.6,175.28 80.25,180.62 65.5,180.62 64.03,179.16 J2.2 | 88.33,167.18 88.45,167.3 U3.1 90.05,167.8 90.5,168.25 91.5,168.25 91.95,167.8 U3.3 | 92.25,125.5 93,125.5 94.25,126.75 94.25,143.68 87,150.93 87,167.1 | TP2.P$1 88.25,167.25 88.33,167.18
50MHZ
  Bottom 0.152: IC1.63 37.81,135.88 Y1.3
BTN_COL1  (via drill 0.3, 0.35)
  Top 0.152: SW8.P$2 SW7.P$2 SW6.P$2 SW5.P$2 129.5,156 127.5,158 122.5,158 99,134.5 99,111.5 94.25,106.75 v73,106.75 | 16,156.5 SW4.P$2 SW3.P$2 16,137.25 | SW1.P$2 SW2.P$2 16,137.25 | v71,106.75 57.75,106.75 v53.75,110.75 50.25,114.25 31.25,114.25 25.25,120.25 25.25,135 23,137.25 16,137.25
  Bottom 0.152: v73,106.75 v71,106.75 | IC1.27 v53.75,110.75
BTN_COL2  (via drill 0.3)
  Top 0.152: v32,101 SW9.P$2 v24.5,104.75 | SW10.P$2 v38,101 | v50,101 SW11.P$2 | v65,101 SW12.P$2 | v80,101 SW13.P$2 | v95,101 SW14.P$2 | v110,101 SW15.P$2 | v124.5,101 SW16.P$2
  Bottom 0.152: v32,101 v38,101 v50,101 53,101 | 53,101 v65,101 v80,101 v95,101 v110,101 v124.5,101 | IC1.28 53.25,111.25 53,111 53,101
BTN_COL3  (via drill 0.3)
  Top 0.152: SW25.P$2 137.5,86.25 130.38,86.25 130.25,86.12 130.25,85 SW24.P$2 v118.25,85 | v23,85 v19,85 SW17.P$2 | SW18.P$2 v29,85 | v42,85 SW19.P$2 | v59,85 SW20.P$2 | v73.88,85 SW21.P$2 | v88.62,85 SW22.P$2 | v103.38,85 SW23.P$2
  Bottom 0.152: v23,85 v29,85 v42,85 v59,85 v73.88,85 v88.62,85 v103.38,85 v118.25,85 | v19,85 19,102.5 23.75,107.25 48.5,107.25 52.75,111.5 IC1.29
BTN_COL4  (via drill 0.3)
  Top 0.152: v23,70.25 v18.25,70.25 14.5,70.25 SW26.P$2 | v29,70.25 30.5,70.25 SW27.P$2 | v42,70.25 46.5,70.25 SW28.P$2 | v59,70.25 63.5,70.25 SW29.P$2 | v73.88,70.25 78.25,70.25 SW30.P$2 | v88.62,70.25 93,70.25 SW31.P$2 | v103.38,70.25 107.88,70.25 SW32.P$2 | v118.25,70.25 122.62,70.25 SW33.P$2 | v133,70.25 137.5,70.25 SW34.P$2
  Bottom 0.152: v23,70.25 v29,70.25 v42,70.25 v59,70.25 v73.88,70.25 v88.62,70.25 v103.38,70.25 v118.25,70.25 v133,70.25 | v18.25,70.25 18.25,102.5 23.5,107.75 48.25,107.75 52.25,111.75 IC1.30
BTN_COL5  (via drill 0.3)
  Top 0.152: v23,55.38 v17.5,55.38 14.5,55.38 SW35.P$2 | v29,55.38 30.5,55.38 SW36.P$2 | v42,55.38 46.5,55.38 SW37.P$2 | v59,55.38 63.5,55.38 SW38.P$2 | v73.88,55.38 78.25,55.38 SW39.P$2 | v88.62,55.38 93,55.38 SW40.P$2 | v103.38,55.38 107.88,55.38 SW41.P$2 | v118.25,55.38 122.62,55.38 SW42.P$2 | v133,55.38 137.5,55.38 SW43.P$2
  Bottom 0.152: v23,55.38 v29,55.38 v42,55.38 v59,55.38 v73.88,55.38 v88.62,55.38 v103.38,55.38 v118.25,55.38 v133,55.38 | v17.5,55.38 17.5,102.5 23.25,108.25 48,108.25 51.75,112 IC1.31
BTN_COL6  (via drill 0.3)
  Top 0.152: SW52.P$2 137.5,39.25 130.5,39.25 130.25,39.5 130.25,40.5 122.75,40.5 SW51.P$2 122.62,40.62 v118.25,40.62 | v23,40.62 v16.75,40.62 14.5,40.62 SW44.P$2 | v29,40.62 30.5,40.62 SW45.P$2 | v42,40.62 46.5,40.62 SW46.P$2 | v59,40.62 63.5,40.62 SW47.P$2 | v73.88,40.62 78.25,40.62 SW48.P$2 | v88.62,40.62 93,40.62 SW49.P$2 | v103.38,40.62 107.88,40.62 SW50.P$2
  Bottom 0.152: v23,40.62 v29,40.62 v42,40.62 v59,40.62 v73.88,40.62 v88.62,40.62 v103.38,40.62 v118.25,40.62 | v16.75,40.62 16.75,102.5 23,108.75 47.75,108.75 51.25,112.25 IC1.32
BTN_COL7  (via drill 0.3)
  Top 0.152: SW55.P$2 54,24.25 46.88,24.25 46.75,24.38 46.75,25.5 SW54.P$2 39,26.5 v37.5,26.5 | v31.12,26.5 SW53.P$2 v19.5,30 | v106.5,25.5 SW58.P$2 | SW59.P$2 v112.5,25.5 | v124.5,26.5 SW60.P$2 | v91.5,25.5 SW57.P$2 84,24.25 76.88,24.25 76.75,24.38 76.75,25.5 SW56.P$2 69,26.5 v67.5,26.5
  Bottom 0.152: v31.12,26.5 v37.5,26.5 v67.5,26.5 | v124.5,26.5 123.5,25.5 v112.5,25.5 v106.5,25.5 v91.5,25.5 | v19.5,30 16,33.5 16,102.5 22.75,109.25 47.5,109.25 50.25,112 IC1.34
BTN_COL8  (via drill 0.3)
  Top 0.152: SW67.P$2 124.5,7.5 114,7.5 | 69,7.5 46.5,7.5 | 83.5,7.5 69,7.5 | 99,7.5 83.5,7.5 | 114,7.5 99,7.5 | 46.5,7.5 26,7.5 23,10.5 SW61.P$2 v23,15.75 | SW62.P$2 46.5,7.5 | SW63.P$2 69,7.5 | SW64.P$2 83.5,7.5 | SW65.P$2 99,7.5 | SW66.P$2 114,7.5
  Bottom 0.152: v23,15.75 15.25,23.5 15.25,102.5 22.5,109.75 47.25,109.75 49.75,112.25 IC1.35
BTN_ROW1  (via drill 0.3, 0.35)
  Top 0.152: SW61.P$1 SW53.P$1 8.5,35 SW44.P$1 SW35.P$1 SW26.P$1 8.5,70.25 8.62,70.38 v8.62,81.5 8.62,83.5 8.5,83.62 SW17.P$1 8.5,91 SW9.P$1 18,101.5 18,118.5 22,122.5 SW1.P$1 23.25,126.75 v23.75,126.75
  Bottom 0.152: IC1.39 47.75,127 47.5,126.75 v23.75,126.75
  Bottom 0.203: R16.2 8.5,81.38 v8.62,81.5
BTN_ROW2  (via drill 0.3, 0.35)
  Top 0.152: SW62.P$1 33,17.5 SW54.P$1 24.5,34 SW45.P$1 SW36.P$1 SW27.P$1 24.5,70.25 24.62,70.38 v24.62,81.5 24.62,83.5 24.5,83.62 SW18.P$1 24.5,92 SW10.P$1 28.5,106 28.5,116 24.5,120 v24.5,126 24.5,133 SW2.P$1
  Bottom 0.152: IC1.38 48.25,126.75 47.5,126 v24.5,126
  Bottom 0.203: R17.2 24.5,81.38 v24.62,81.5
BTN_ROW3  (via drill 0.3, 0.35)
  Top 0.152: SW55.P$1 40.5,33 SW46.P$1 SW37.P$1 SW28.P$1 40.5,70.25 40.62,70.38 v40.62,81.5 40.62,83.5 40.5,83.62 SW19.P$1 48.5,93 SW11.P$1 48.5,111.75 48.25,112 48.25,113.25 v48.5,113.5 | SW3.P$1 26,141.5 26,120.5 31.5,115 v48.5,115
  Bottom 0.152: v48.5,113.5 v48.5,115 48.5,115.5 48.25,115.75 48.25,116.5 48.75,117 IC1.37
  Bottom 0.203: R18.2 40.5,81.38 v40.62,81.5
BTN_ROW4  (via drill 0.3, 0.35)
  Top 0.152: 61.5,101 SW12.P$1 | 63,13.12 SW56.P$1 57.5,31 SW47.P$1 SW38.P$1 SW29.P$1 57.5,70.25 57.62,70.38 v57.62,81.5 57.62,83.5 57.5,83.62 SW20.P$1 61.5,89 61.5,101 | 63,13.12 SW63.P$1 | SW64.P$1 74.38,13.12 63,13.12 | 61.5,101 60.5,101 v49,112.5 | SW4.P$1 26.75,150.75 26.75,120.75 31.5,116 v49,116
  Bottom 0.152: v49,112.5 49.25,112.75 49.25,115.75 v49,116 49.25,116.25 IC1.36
  Bottom 0.203: R19.2 57.5,81.38 v57.62,81.5
BTN_ROW5  (via drill 0.3)
  Top 0.152: SW5.P$1 100,132 100,111 93,104 81,104 v79.75,102.75 78.5,101.5 SW13.P$1 78.5,91.12 72.38,85 SW21.P$1 72.25,85 v72.25,81.5 72.25,70.25 SW30.P$1 72.38,70.12 72.38,55.5 SW39.P$1 72.38,55.38 72.38,40.62 SW48.P$1 72.38,40.5 72.38,31.12 SW57.P$1
  Bottom 0.152: v79.75,102.75 61.25,102.75 57.5,106.5 57.5,129.5 57.12,129.88 IC1.25
  Bottom 0.203: R20.2 72,81.25 v72.25,81.5
BTN_ROW6  (via drill 0.3)
  Top 0.152: SW6.P$1 104.5,126.5 104.5,112 v96,103.5 SW14.P$1 87.12,94.62 87.12,85 | SW65.P$1 SW58.P$1 87.12,31.38 87.12,40.5 SW49.P$1 87.12,40.62 87.12,55.38 SW40.P$1 87.12,55.5 87.12,70.12 SW31.P$1 87.12,70.25 v87.12,81.5 87.12,85 | 87.12,85 SW22.P$1
  Bottom 0.152: v96,103.5 61.25,103.5 58,106.75 58,129.75 57.38,130.38 IC1.24
  Bottom 0.203: R21.2 87,81.38 v87.12,81.5
BTN_ROW7  (via drill 0.3)
  Top 0.152: SW7.P$1 108.5,120.5 v108.5,104.25 SW15.P$1 102,94.5 102,85 | SW66.P$1 SW59.P$1 102,31.5 102,40.5 SW50.P$1 102,40.62 102,55.38 SW41.P$1 102,55.5 102,70.12 SW32.P$1 102,70.25 102.12,70.38 v102.12,81.5 102.12,83.5 102,83.62 102,85 | 102,85 SW23.P$1
  Bottom 0.152: v108.5,104.25 61.25,104.25 58.5,107 58.5,130.5 57.12,131.88 IC1.21
  Bottom 0.203: R22.2 102,81.38 v102.12,81.5
BTN_ROW8  (via drill 0.3)
  Top 0.152: SW8.P$1 127,122 v127,105 SW16.P$1 116.75,94.75 116.75,85 | 116.75,85 v116.75,81.5 116.75,70.25 SW33.P$1 116.75,70.12 116.75,55.5 SW42.P$1 116.75,55.38 116.75,40.62 SW51.P$1 116.75,40.5 116.75,32.75 SW60.P$1 SW67.P$1 | 116.75,85 SW24.P$1
  Bottom 0.152: v127,105 61.25,105 59,107.25 59,130.75 57.38,132.38 IC1.20
  Bottom 0.203: R23.2 116.5,81.25 v116.75,81.5
BTN_ROW9  (via drill 0.3)
  Top 0.152: SW52.P$1 SW43.P$1 SW34.P$1 131.5,70.25 131.62,70.38 v131.62,81.5 131.62,83.5 131.5,83.62 SW25.P$1
  Bottom 0.152: v131.62,81.5 131.62,101.88 127.75,105.75 61.25,105.75 59.5,107.5 59.5,131 57.62,132.88 IC1.19
  Bottom 0.203: R24.2 131.5,81.38 v131.62,81.5
CPLD_JTAGENB
  Bottom 0.203: R5.1 45.6,146.85 45.25,146.5 IC1.82
CPLD_TCK
  Bottom 0.203: IC1.91 49.75,153.1 J1.4
CPLD_TDI
  Bottom 0.203: IC1.94 51.25,146.5 50.75,147 J1.3
CPLD_TDO
  Bottom 0.203: J1.2 53.29,152.29 52.25,151.25 52.25,147 51.75,146.5 IC1.95
CPLD_TMS
  Bottom 0.203: IC1.90 49.25,147.36 J1.5
DCLK  (via drill 0.35)
  Top 0.152: X2.30 68,129 v63.88,133.12
  Bottom 0.152: v63.88,133.12 60.62,136.38 IC1.12
DE  (via drill 0.35)
  Top 0.152: X2.34 66,128.38 v61.25,133.12
  Bottom 0.152: v61.25,133.12 59.5,134.88 IC1.15
G0  (via drill 0.35)
  Top 0.152: X2.13 76.5,131.12 v74.5,133.12
  Bottom 0.152: v74.5,133.12 65.75,141.88 IC1.1
G1  (via drill 0.35)
  Top 0.152: X2.14 76,130.75 v73.62,133.12
  Bottom 0.152: v73.62,133.12 65.38,141.38 IC1.2
G2  (via drill 0.35)
  Top 0.152: X2.15 75.5,130.38 v72.75,133.12
  Bottom 0.152: v72.75,133.12 65,140.88 IC1.3
G3  (via drill 0.35)
  Top 0.152: X2.16 75,130 v71.88,133.12
  Bottom 0.152: v71.88,133.12 64.62,140.38 IC1.4
G4  (via drill 0.35)
  Top 0.152: X2.17 74.5,129.62 v71,133.12
  Bottom 0.152: v71,133.12 65.25,138.88 IC1.7
G5  (via drill 0.35)
  Top 0.152: X2.18 74,129.25 v70.12,133.12
  Bottom 0.152: v70.12,133.12 64.88,138.38 IC1.8
G6  (via drill 0.35)
  Top 0.152: X2.19 73.5,128.88 v69.25,133.12
  Bottom 0.152: v69.25,133.12 64.5,137.88 IC1.9
G7  (via drill 0.35)
  Top 0.152: X2.20 73,128.5 v68.38,133.12
  Bottom 0.152: v68.38,133.12 64.12,137.38 IC1.10
GND  (via drill 0.3, 0.35)
  Top 0.203: 72.5,128.38 X2.21 72.5,126 | 72,128.38 X2.22 v72,126 | 71.5,128.38 X2.23 71.5,126 | 71,128.38 X2.24 71,126 | 70.5,128.38 X2.25 v70.5,126 | 70,128.38 X2.26 70,126 | 69.5,128.38 X2.27 69.5,126 | 69,128.38 X2.28 v69,126 | 68.5,126 X2.29 68.5,128.38 | 77,128.38 X2.12 77,126 | 77.5,128.38 X2.11 77.5,126 | 78,128.38 X2.10 v78,126 | 78.5,128.38 X2.9 78.5,126 | 79,128.38 X2.8 79,126 | 79.5,128.38 X2.7 79.5,126 | 80,128.38 X2.6 80,126 | 80.5,128.38 X2.5 80.5,126 | 81.5,126 X2.3 81.5,128 81.62,128.12 82.5,128.12 | 82.48,127.19 X2.1 | X2.1 82.5,126 | v67,82 67,90.5 72,95.5 72,111.5 | X2.1 82.5,128.12 | 82.5,128.12 83.12,128.12
  Bottom 0.203: J3.5 85.38,161 85.62,160.75 85.62,158.75 85.33,158.46 J3.9 | C6.2 65.25,158.19 66.5,159.44 66.5,159.88 66.88,160.25 U1.5 | IC1.92 v50.25,141.75 | IC1.79 43.75,145 43.38,145.38 | IC1.72 39,140.38 v38.75,140.62 | IC1.56 39.12,132.38 38.88,132.62 | R15.1 v67,82 | U1.41 72.75,154.75 73,154.5 | IC1.22 55,131.38 v54.88,131.5 | IC1.33 v50.75,129.75 | IC1.44 v45.25,129.75 | IC1.6 57.75,139.38 v58,139.62
  other vias: 27.75,127.5 27.75,130.5 27.75,133.5 27.75,136.5 27.75,139.5 27.75,142.5 27.75,145.5 27.75,148.5 27.75,151.5 27.75,154.5 27.75,157.5 27.75,160.5 27.75,163.5 27.75,166.5 27.75,169.5 27.75,172.5 29.25,127.5 28.5,129 29.25,130.5 28.5,132 29.25,133.5 28.5,135 29.25,136.5 28.5,138 29.25,139.5 28.5,141 29.25,142.5 28.5,144 29.25,145.5 28.5,147 29.25,148.5 28.5,150 29.25,151.5 28.5,153 29.25,154.5 28.5,156 29.25,157.5 28.5,159 29.25,160.5 28.5,162 29.25,163.5 28.5,165 29.25,166.5 28.5,168 29.25,169.5 28.5,171 28.5,180 30.75,127.5 30,129 30.75,130.5 30,135 30.75,136.5 30,138 30.75,139.5 30,141 30.75,142.5 30,144 30,147 30.75,148.5 30,150 30.75,151.5 30,153 30.75,154.5 30,156 30.75,157.5 30,159 30.75,160.5 30,162 30.75,163.5 30,165 30.75,166.5 30,168 30.75,169.5 30,171 32.25,127.5 31.5,129 32.25,133.5 31.5,135.12 31.5,138 32.25,139.5 31.5,141 32.25,148.5 32.25,151.5 31.5,153 32.25,154.5 31.5,156 32.25,157.5 31.5,159 32.25,160.5 31.5,162 32.25,163.5 31.5,165 32.25,166.5 31.5,168 32.25,169.5 31.5,171 33.75,127.5 33,129 33,132.25 33.75,133.5 33,138 33.75,139.5 33.75,148.5 33.75,151.5 33,153 33.75,154.5 33,156 33.75,157.5 33,159 33.75,160.5 33,162 33.75,163.5 33,165 33.75,166.5 33,168 33.75,169.5 33,171 33.75,172.5 33,180 35.25,127.5 34.5,129 34.5,132.25 35.25,133.5 35.25,136.5 34.5,138 35.25,148.5 35.25,151.5 34.5,153 35.25,154.5 34.5,156 35.25,157.5 34.5,159 35.25,160.5 34.5,162 35.25,163.5 34.5,165 35.25,166.5 34.5,168 35.25,169.5 34.5,171 35.25,172.5 34.5,174 35.25,175.5 35.25,178.5 34.5,180 36.75,127.5 36,129 36,132.25 36.75,133.5 36,135 36.75,148.5 36.75,151.5 36,153 36.75,154.5 36,156 36.75,157.5 36,159 36.75,160.5 36,162 36.75,163.5 36,165 36.75,166.5 36,168 36.75,169.5 36,171 36.75,172.5 36,174 36.75,175.5 36,177 36.75,178.5 36,180 38.25,127.5 37.5,129 37.5,132.25 38.25,133.5 38.25,142.5 38.25,148.5 38.25,151.5 37.5,153 38.25,154.5 37.5,156 38.25,157.5 37.5,159 38.25,160.5 37.5,162 38.25,163.5 37.5,165 38.25,166.5 37.5,168 38.25,169.5 37.5,171 38.25,172.5 37.5,174 38.25,175.5 37.5,177 38.25,178.5 37.5,180 39.75,127.5 39,129 39,144 39.75,145.5 39,147 39.75,148.5 39.75,151.5 39,153 39.75,154.5 39,156 39.75,157.5 39,159 39.75,160.5 39,162 39.75,163.5 39,165 39.75,166.5 39,168 39.75,169.5 39,171 39.75,172.5 39,174 39.75,175.5 39,177 39.75,178.5 39,180 41.25,127.5 40.5,129 41.25,142.5 40.5,144 41.25,145.5 40.5,147 41.25,151.5 40.5,153 41.25,154.5 40.5,156 41.25,157.5 40.5,159 41.25,160.5 40.5,162 41.25,163.5 40.5,165 41.25,166.5 40.5,168 41.25,169.5 40.5,171 41.25,172.5 40.5,174 41.25,175.5 40.5,177 41.25,178.5 40.5,180 42.75,142.5 42.75,145.5 42.75,151.5 42,153 42.75,154.5 42,156 42.75,157.5 42,159 42.75,160.5 42,162 42.75,163.5 42,165 42.75,166.5 42,168 42.75,169.5 42,171 42.75,172.5 42,174 42.75,175.5 42,177 42.75,178.5 42,180 43.5,132 44.25,133.5 43.5,135 44.25,136.5 43.5,138 44.25,139.5 43.5,153 44.25,154.5 43.5,156 44.25,157.5 43.5,159 44.25,160.5 43.5,162 44.25,163.5 43.5,165 44.25,166.5 43.5,168 44.25,169.5 43.5,171 44.25,172.5 43.5,174 44.25,175.5 43.5,177 44.25,178.5 43.5,180 45,132 45.75,133.5 45,135 45.75,136.5 45,138 45.75,139.5 45,141 45.75,142.5 45,153 45.75,154.5 45,156 45.75,157.5 45,159 45.75,160.5 45,162 45.75,163.5 45,165 45.75,166.5 45,168 45.75,169.5 45,171 45.75,172.5 45,174 45.75,175.5 45,177 45.75,178.5 45,180 46.5,132 47.25,133.5 46.5,135 47.25,136.5 46.5,138 47.25,139.5 46.5,141 47.25,142.5 46.5,156 47.25,157.5 46.5,159 47.25,160.5 46.5,162 47.25,163.5 46.5,165 47.25,166.5 46.5,168 47.25,169.5 46.5,171 47.25,172.5 46.5,174 47.25,175.5 46.5,177 47.25,178.5 46.5,180 48,132 48.75,133.5 48,135 48.75,136.5 48,138 48.75,139.5 48,141 48.75,142.5 48,156 48.75,157.5 48,159 48.75,160.5 48,162 48.75,163.5 48,165 48.75,166.5 48,168 48.75,169.5 48,171 48.75,172.5 48,174 48.75,175.5 48,177 48.75,178.5 48,180 49.5,132 50.25,133.5 49.5,135 50.25,136.5 49.5,138 50.25,139.5 49.5,141 49.5,156 50.25,157.5 49.5,159 50.25,160.5 49.5,162 50.25,163.5 49.5,165 50.25,166.5 49.5,168 50.25,169.5 49.5,171 50.25,172.5 49.5,174 50.25,175.5 49.5,177 50.25,178.5 49.5,180 51,132 51.75,133.5 51,135 51.75,136.5 51,138 51.75,139.5 51,141 51,150.12 52,154.5 51,156 51.75,157.5 51,159 51.75,160.5 51,162 51.75,163.5 51,165 51.75,166.5 51,168 51.75,169.5 51,171 51.75,172.5 51,174 51.75,175.5 51,177 51.75,178.5 51,180 52.5,132 53.25,133.5 52.5,135 53.25,136.5 52.5,138 53.25,139.5 52.5,141 52.5,156 53.25,157.5 52.5,159 53.25,160.5 52.5,162 53.25,163.5 52.5,165 53.25,166.5 52.5,168 53.25,169.5 52.5,171 53.25,172.5 52.5,174 53.25,175.5 52.5,177 53.25,178.5 52.5,180 54.75,148.5 54,150 54.75,151.5 54.75,154.5 54,156 54.75,157.5 54,159 54.75,160.5 54,162 54.75,163.5 54,165 54.75,166.5 54,168 54.75,169.5 54,171 54.75,172.5 54,174 54.75,175.5 54,177 54.75,178.5 54,180 55.5,147 55.5,150 56.25,151.5 55.5,153 56.25,154.5 55.5,156 56.25,157.5 55.5,159 56.25,160.5 55.5,162 56.25,163.5 55.5,165 56.25,166.5 55.5,168 56.25,169.5 55.5,171 56.25,172.5 55.5,174 56.25,175.5 55.5,177 56.25,178.5 55.5,180 57.75,133.5 57,147 57.75,148.5 57.75,151.5 57,153 57.75,154.5 57,156 57.75,157.5 57,159 57.75,160.5 57,162 57.75,163.5 57,165 57.75,166.5 57,168 57.75,169.5 57,171 57.75,172.5 57,174 57.75,175.5 57,177 57.75,178.5 57,180 59.25,133.5 59.25,139.62 58.5,147 59.25,148.5 58.5,150 59.62,157.5 59.62,160.5 59.25,169.5 58.5,171 59.25,172.5 58.5,174 59.25,175.5 58.5,177 59.25,178.5 58.5,180 60.75,112.5 60.25,114 60.75,115.5 60.25,117 60.75,118.5 60.75,121.5 60.75,124.5 60.25,126 60.75,127.5 60,132 60.75,139.62 60,147 60.75,148.5 60,150 60.75,151.5 60,153 60,156 60,159 60.88,160.5 60,162 60,165 60,167.75 60,171 60,174 60,177 60.75,178.5 60,180 62.25,112.5 61.5,114 61.5,117 61.5,120 62.25,121.5 61.5,123 61.5,126 62.25,127.5 62.25,136.5 62.25,139.62 61.5,147 62.25,148.5 61.5,150 62.25,151.5 62.25,160.5 61.5,162 61.5,171 61.5,177 62.25,178.5 61.5,180 63.75,112.5 63,114 63,120 63.75,121.5 63,126 63,129 63,135 63.75,136.5 63.75,139.62 63,147 63.75,148.5 63,150 63.75,151.5 63,153 63.75,154.5 63.75,157 63.75,160.5 63,162 63.5,167.5 63.75,169.5 63.75,172.5 63,174 63,180 65.25,112.5 64.5,114 64.5,120 64.5,129 65.25,133.5 64.5,135 64.5,147 65.25,148.5 64.5,150 65.25,151.5 65.25,154.5 64.5,156 65.38,165.38 65.25,169.5 64.5,171 65.25,172.5 64.5,174 65.25,175.5 65.25,178.5 66.75,112.5 66,114 66,120 66,126 66,132 66.75,133.5 66,147 66.75,148.5 66,150 66.75,151.5 66,156 66.75,166.5 66,168 66.75,169.5 66,171 66.75,172.5 66,174 66.75,175.5 66,177 66.75,178.5 68.25,112.5 67.5,114 68.25,124.5 67.5,126 68.25,130.5 67.5,132 67.5,141 67.5,147 68.25,148.5 67.5,150 68.25,151.5 67.5,165 68.25,166.5 69.75,112.5 69,114 69,123 69.75,124.5 69,129 69.75,130.5 69.75,139.5 69,141 69.75,142.5 69,147 69.75,148.5 69,150 69.75,151.5 69.75,163.5 71.25,112.5 70.5,114 71.25,115.5 70.5,123 71.25,124.5 70.5,129 70.5,138 71.25,139.5 70.5,141 71.25,142.5 70.5,144 70.5,150 71.25,163.5 72.75,112.5 72,114 72.75,115.5 72.75,118.5 72.75,121.5 72,123 72.75,124.5 72.75,136.5 72,138 72.75,139.5 72,141 72.75,142.5 72,144 72.75,145.5 72.38,151.38 72.75,154.5 72.75,160.5 72,162 72.75,163.5 74.25,112.5 73.5,114 74.25,115.5 73.5,117 74.25,118.5 73.5,123 74.25,124.5 73.5,126 73.5,135 74.25,136.5 73.5,138 74.25,139.5 73.5,141 74.25,142.5 73.5,144 74.25,145.5 73.5,147 73.75,151.38 73.5,153 74.25,154.5 75.75,112.5 75,114 75.75,115.5 75,117 75.75,118.5 75,120 75,123 75.75,124.5 75,126 75.75,133.5 75,135 75.75,136.5 75,138 75.75,139.5 75,141 75.75,142.5 75,144 75.75,145.5 75,147 75,153 75.75,154.5 75,168 75.75,169.5 77.25,112.5 76.5,114 77.25,115.5 76.5,117 77.25,118.5 76.5,120 77.25,121.5 76.5,126 77.25,130.5 76.5,132 77.25,133.5 76.5,135 77.25,136.5 76.5,138 77.25,139.5 76.5,141 77.25,142.5 76.5,144 77.25,145.5 76.5,147 76.5,150 77.25,151.5 76.5,156 76.5,168 77.25,169.5 78.75,112.5 78,114 78.75,115.5 78,117 78.75,118.5 78,120 78.75,121.5 78,123 78,129 78.75,130.5 78,132 78.75,133.5 78,135 78.75,136.5 78,138 78.75,139.5 78,141 78.75,142.5 78,144 78.75,145.5 78,147 78,150 78.75,151.5 78.75,166.5 78,168 78.75,178.5 80.25,112.5 79.5,114 80.25,115.5 79.5,117 80.25,118.5 79.5,120 80.25,121.5 79.5,123 80.25,124.5 79.5,129 80.25,130.5 79.5,132 80.25,133.5 79.5,135 80.25,136.5 79.5,138 80.25,139.5 79.5,141 80.25,142.5 79.5,144 80.25,145.5 79.5,147 79.5,150 80.25,151.5 79.5,153 80.25,154.5 80.25,175.5 80.25,178.5 81.75,112.5 81,114 81.75,115.5 81,117 81.75,118.5 81,120 81.75,121.5 81,123 81,126 81.75,130.5 81,132 81.75,133.5 81,135 81.75,136.5 81,138 81.75,139.5 81,141 81.75,142.5 81,144 81.75,145.5 81,147 81,150 81.75,151.5 81,153 81.75,154.5 82,163.75 80.25,170 81.75,175.5 81,177 83.25,112.5 82.5,114 83.25,115.5 82.5,117 83.25,118.5 82.5,120 83.25,121.5 82.5,123 83.25,124.5 83.25,127.5 82.5,132 83.25,133.5 82.5,135 83.25,136.5 82.5,138 83.25,139.5 82.5,141 83.25,142.5 82.5,144 83.25,145.5 82.5,147 82.5,150 83.25,151.5 82.5,153 83.25,154.5 82.5,156 83.25,157.5 82.5,169.62 82.5,171 83.25,172.5 82.5,174 83.25,175.5 82.5,177 82.5,180 84.75,112.5 84,114 84.75,115.5 84,117 84.75,118.5 84,120 84.75,121.5 84,123 84.75,124.5 84,126 84,132 84.75,133.5 84,135 84.75,136.5 84,138 84.75,139.5 84,141 84.75,142.5 84,144 84.75,145.5 84,147 84,150 84.75,151.5 84,153 84.75,154.5 84,156 84.75,157.5 84,165 84.75,169.5 84.5,171 84.75,172.5 84,174 84.75,178.5 84,180 86.25,112.5 85.5,114 86.25,115.5 85.5,117 85.5,120 85.5,123 85.5,126 86.25,130.5 85.5,135 85.5,138 85.5,141 85.5,144 85.5,147 85.5,150 85.5,153 85.5,156 86.12,164.12 85.5,165 86.25,169.5 86.25,172.5 86.25,175.5 85.5,177 86.25,178.5 85.5,180 87.75,112.5 87,114 87.75,115.5 87,117 87,126 87,129 87.75,130.5 87,132 87.75,133.5 87,135 87.75,136.5 87,138 87.75,139.5 87,141 87.75,142.5 87,144 87.75,145.5 87,147 87.75,148.5 87,150 87.75,151.5 87.75,154.5 87.75,157.5 87.75,160.5 87.75,163.5 87,168 87,171 87.75,172.5 87,174 87.75,175.5 87,177 87.75,178.5 87,180 89.25,112.5 88.5,114 89.25,115.5 88.5,117 88.5,120 88.5,122.62 89.25,124.75 89.25,133.5 88.5,135 89.25,136.5 88.5,138 89.25,139.5 88.5,141 89.25,142.5 88.5,144 89.25,145.5 88.5,147 89.25,151.5 88.5,153 89.25,154.5 88.5,156 89.25,157.5 88.5,159 89.25,163.5 89.38,166 89.25,169.5 88.5,171 89.25,172.5 88.5,174 89.25,175.5 88.5,177 89.25,178.5 88.5,180 90.75,112.5 90,114 90.75,115.5 90,117 90,123 90.75,133.5 90,135 90.75,136.5 90,138 90.75,139.5 90,141 90.75,142.5 90,144 90.75,145.5 90,147 90.75,148.5 90,150 90.75,151.5 90,153 90.75,154.5 90,156 90.75,157.5 90,159 91,163.62 90.75,169.5 90,171 90.75,172.5 90,174 90.75,175.5 90,177 90.75,178.5 90,180 92.25,112.5 91.5,114 92.25,115.5 91.5,117 92.25,130.5 91.75,132 92.25,133.5 91.5,135 92.25,136.5 91.5,138 92.25,139.5 91.5,141 92.25,142.5 91.5,144 92.25,148.5 91.5,150 92.25,151.5 91.5,153 92.25,154.5 91.5,156 92.25,157.5 91.5,159 92.25,160.5 92.25,163.5 92.25,169.5 91.5,171 92.25,172.5 91.5,174 92.25,175.5 91.5,177 92.25,178.5 91.5,180 93.75,112.5 93,114 93.75,115.5 93,117 93.88,118.5 94,121.5 93,123 93.75,124.5 93.38,129 93,132 93,135 93,138 93,141 93.75,145.5 93,147 93.75,148.5 93,150 93.75,151.5 93,153 93.75,154.5 93,156 93.75,157.5 93,159 93.75,160.5 93,162 93.75,163.5 93,165 93.75,166.5 93,168 93.75,169.5 93,171 93.75,172.5 93,174 93.75,175.5 93,177 93.75,178.5 93,180 95.25,112.5 94.5,114 95.25,115.5 94.5,117 95.25,118.5 94.5,120 95.25,121.5 94.5,123 95.25,124.5 94.5,126 95.25,127.5 95.25,130.5 95.25,133.5 95.25,136.5 95.25,139.5 95.25,142.5 95.25,145.5 94.5,147 95.25,148.5 94.5,150 95.25,151.5 94.5,153 95.25,154.5 94.5,156 95.25,157.5 94.5,159 95.25,160.5 94.5,162 95.25,163.5 94.5,165 95.25,166.5 94.5,168 95.25,169.5 94.5,171 95.25,172.5 94.5,174 95.25,175.5 94.5,177 95.25,178.5 94.5,180 96.75,112.5 96,114 96.75,115.5 96,117 96.75,118.5 96,120 96.75,121.5 96,123 96.75,124.5 96,126 96.75,127.5 96,129 96.75,130.5 96,132 96.75,133.5 96,135 96.75,136.5 96,138 96.75,139.5 96,141 96.75,142.5 96,144 96.75,145.5 96,147 96.75,148.5 96,150 96.75,151.5 96,153 96.75,154.5 96,156 96.75,157.5 96,159 96.75,160.5 96,162 96.75,163.5 96,165 96.75,166.5 96,168 96.75,169.5 96,171 96.75,172.5 96,174 96.75,175.5 96,177 96.75,178.5 96,180 66.5,159.75 82,162.5 64.38,166.5 63.62,165.38 91,166 74.5,170.5
  pour Bottom (isolate 0.406): 27.75,111 97.5,111 97.5,181.5 27.75,181.5
  pour Top (isolate 0.406): 97.5,111 27.75,111 27.75,181.5 97.5,181.5
HSYNC  (via drill 0.35)
  Top 0.152: X2.32 67,129.12 v63,133.12
  Bottom 0.152: v63,133.12 60.25,135.88 IC1.13
LCD_NRESET  (via drill 0.3)
  Top 0.152: v65,125.25 X2.36
  Bottom 0.152: IC2.7 v65.01,125.24 v65,125.25
  Bottom 0.203: R9.2 67.72,119.9 65.01,122.61 IC2.7
LED1
  Bottom 0.152: R25.1 31.5,142.75 36.88,137.38 IC1.66
LED2
  Bottom 0.152: R26.1 33.5,142.75 38.38,137.88 IC1.67
LED3
  Bottom 0.152: IC1.68 39.12,138.38 35.5,142 R27.1
LED4
  Bottom 0.152: IC1.69 39.38,138.88 37.5,140.75 R28.1
MCU_LED
  Bottom 0.203: U1.43 71.75,152.8 D1.A
MISO
  Bottom 0.152: U1.27 77.5,162.75 78.62,161.62 82,161.62 82.38,161.25 82.38,157.88 69.5,145 54,145 53.75,144.75 IC1.99
N$1
  Bottom 0.203: L1.1 D2.A 87.25,124.19 U2.5
N$3
  Bottom 0.203: C10.2 R13.1 | R13.1 90.6,127.1 90,126.5 90,125.25 90.5,124.75 U2.2 | R13.1 92.15,127.5 R14.2
N$4
  Bottom 0.203: IC2.2 65.01,116.86 65.38,116.5 68.97,116.5 C8.2 70.38,118.1 R12.1
N$5
  Bottom 0.152: D4.C R26.2
N$6
  Bottom 0.152: R8.2 D1.C
N$7
  Bottom 0.152: D5.C R27.2
N$8
  Bottom 0.203: R10.2 R11.1 63.74,115.27 IC2.3 63.73,118.14
N$9
  Bottom 0.152: D6.C R28.2
N$10  (via drill 0.3)
  Top 0.152: v14.5,78.75 v19,78.75
  Bottom 0.152: R24.1 R23.1 R22.1 R21.1 R20.1 R15.2 R19.1 R18.1 R17.1 24.4,78.75 v19,78.75 | v14.5,78.75 8.6,78.75 R16.1
N$17
  Bottom 0.152: D3.C R25.2
N$60
  Bottom 0.203: X1.M3 X1.M2 X1.M1 79.65,176.28 R1.2 C1.1 78.28,171.75 X1.M4
NRESET  (via drill 0.3)
  Top 0.152: v74.5,158.5 73.75,159.25 v72.43,159.25
  Bottom 0.152: J3.10 78.79,157.25 77.63,157.25 C5.1 75.8,157.2 v74.5,158.5 | v72.43,159.25 U1.3 67,159.25 66.75,159 66.75,154.9 R6.1
SCK
  Bottom 0.152: U1.31 77.62,160.75 78,160.38 81.38,160.38 81.62,160.12 81.62,158.12 69.25,145.75 53.75,145.75 52.75,144.75 IC1.97
SSEL
  Bottom 0.152: U1.10 66.88,162.75 66.5,163.12 66.5,165.75 63.12,169.12 60.25,169.12 58.75,167.62 58.75,151.25 52.25,144.75 IC1.96
SWCLK
  Bottom 0.152: J3.4 78.98,162.27 77,164.25 75.5,164.25 74.75,163.5 74.75,162 75,161.75 U1.29
SWDIO
  Bottom 0.152: J3.2 78.71,163.54 77.5,164.75 75.5,164.75 73.75,163 U1.39
SWO/MOSI
  Bottom 0.152: U1.28 77,162.25 78.25,161 J3.6 81.75,161 82,160.75 82,158 69.38,145.38 53.88,145.38 53.25,144.75 IC1.98
USB_D_N
  Bottom 0.152: R2.1 72.35,170.2 72.35,170.75 71.95,171.15 X1.2
USB_D_P
  Bottom 0.152: R3.1 72.65,170.2 72.65,170.75 72.75,170.85 X1.3
USB_DX_N
  Bottom 0.152: U1.19 72.25,166.15 72.35,166.25 72.35,166.8 R2.2
USB_DX_P
  Bottom 0.152: U1.20 72.75,166.15 72.65,166.25 72.65,166.8 R3.2 | 73.65,167.5 R3.2 | R4.2 74.9,166.25 R3.2
USB_VBUS/ISP_MODE
  Bottom 0.152: U1.14 69.75,167.6 R7.2
  Bottom 0.203: R7.2 67.22,170.12 64.38,170.12 61.49,173 J2.1
USB_VCC
  Bottom 0.152: C2.1 80.8,168.2 Q1.2
  Bottom 0.203: X1.1 71.15,174.4 71.75,175 74.25,175 75.25,174 75.25,171 76,170.25 78.75,170.25 C2.1
VLED+  (via drill 0.35)
  Top 0.203: v82,125 X2.2
  Bottom 0.203: D2.C 87.4,127.5 R13.2 C10.1 C11.1 | 87.15,127.75 D2.C | D2.C 87.15,127.75 | 87.15,127.75 TP4.P$1 v82,125
VSYNC  (via drill 0.35)
  Top 0.152: X2.33 66.5,128.75 v62.12,133.12
  Bottom 0.152: v62.12,133.12 59.88,135.38 IC1.14
XTALIN
  Bottom 0.203: U1.6 66.25,160.75 65.25,159.75 | 65.25,159.75 C6.1 | XTAL1.1 65.25,159.75
XTALOUT
  Bottom 0.203: U1.7 66.25,161.25 65.25,162.25 | 65.25,162.25 C7.1 | XTAL1.2 65.25,162.25

### Text on the board
bPlace: VREF | TCK | TDO | TMS | TDI | GND
bNames: GND | 5V | 3.3V | VLED+ | A-10C Warthog CDU / Created By: Damy van Valenberg / Version 1.0